# EAGLE design schematic_March8 (EAGLE 7.6.0)
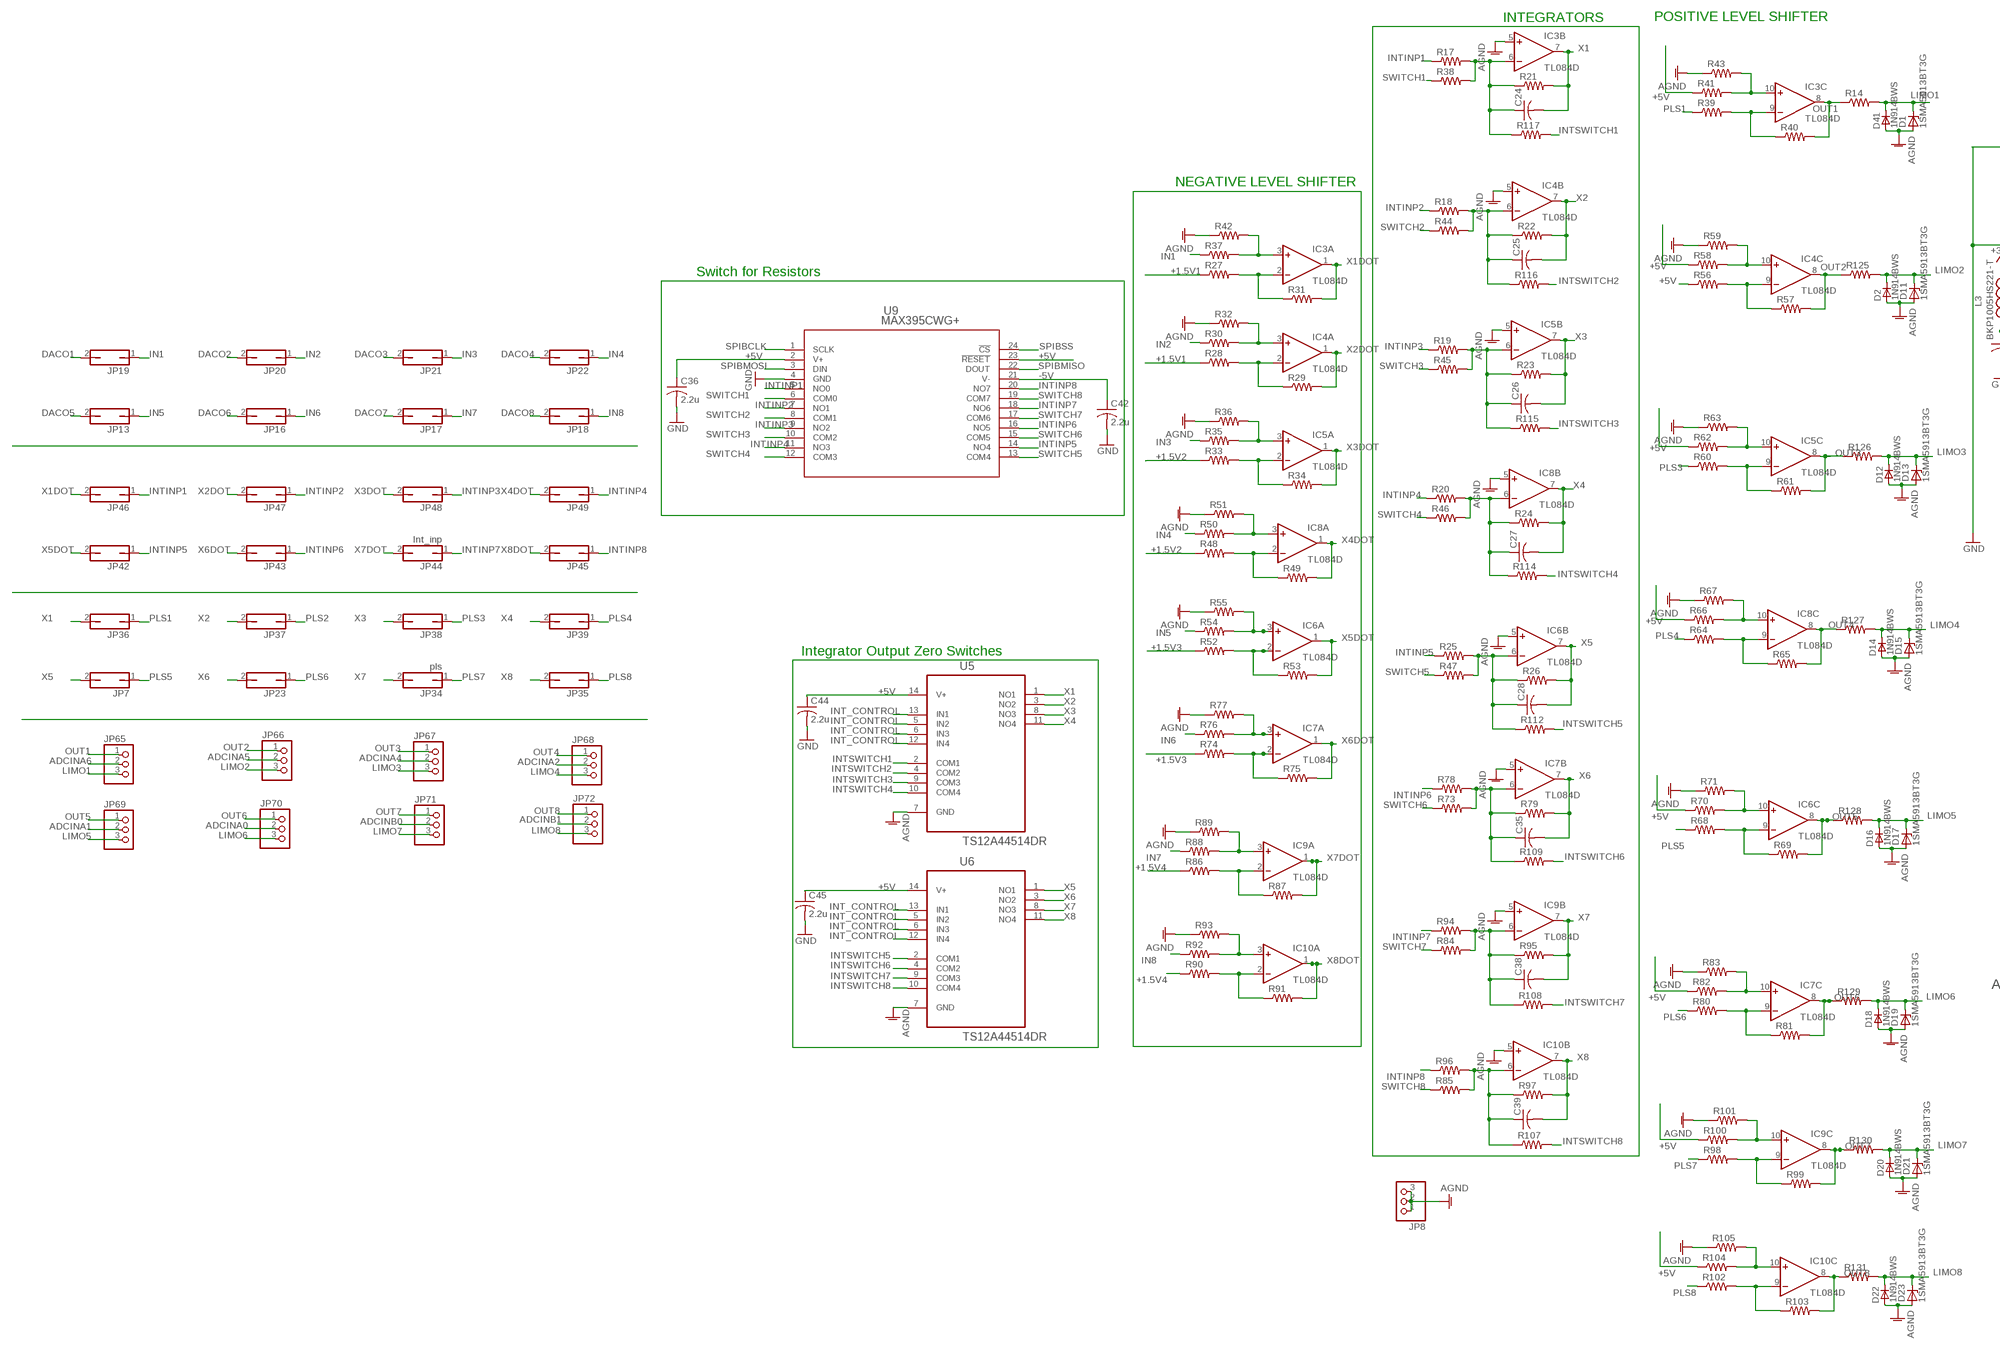
[diagram p0: schematic, sheet 1, part 1 of 2]
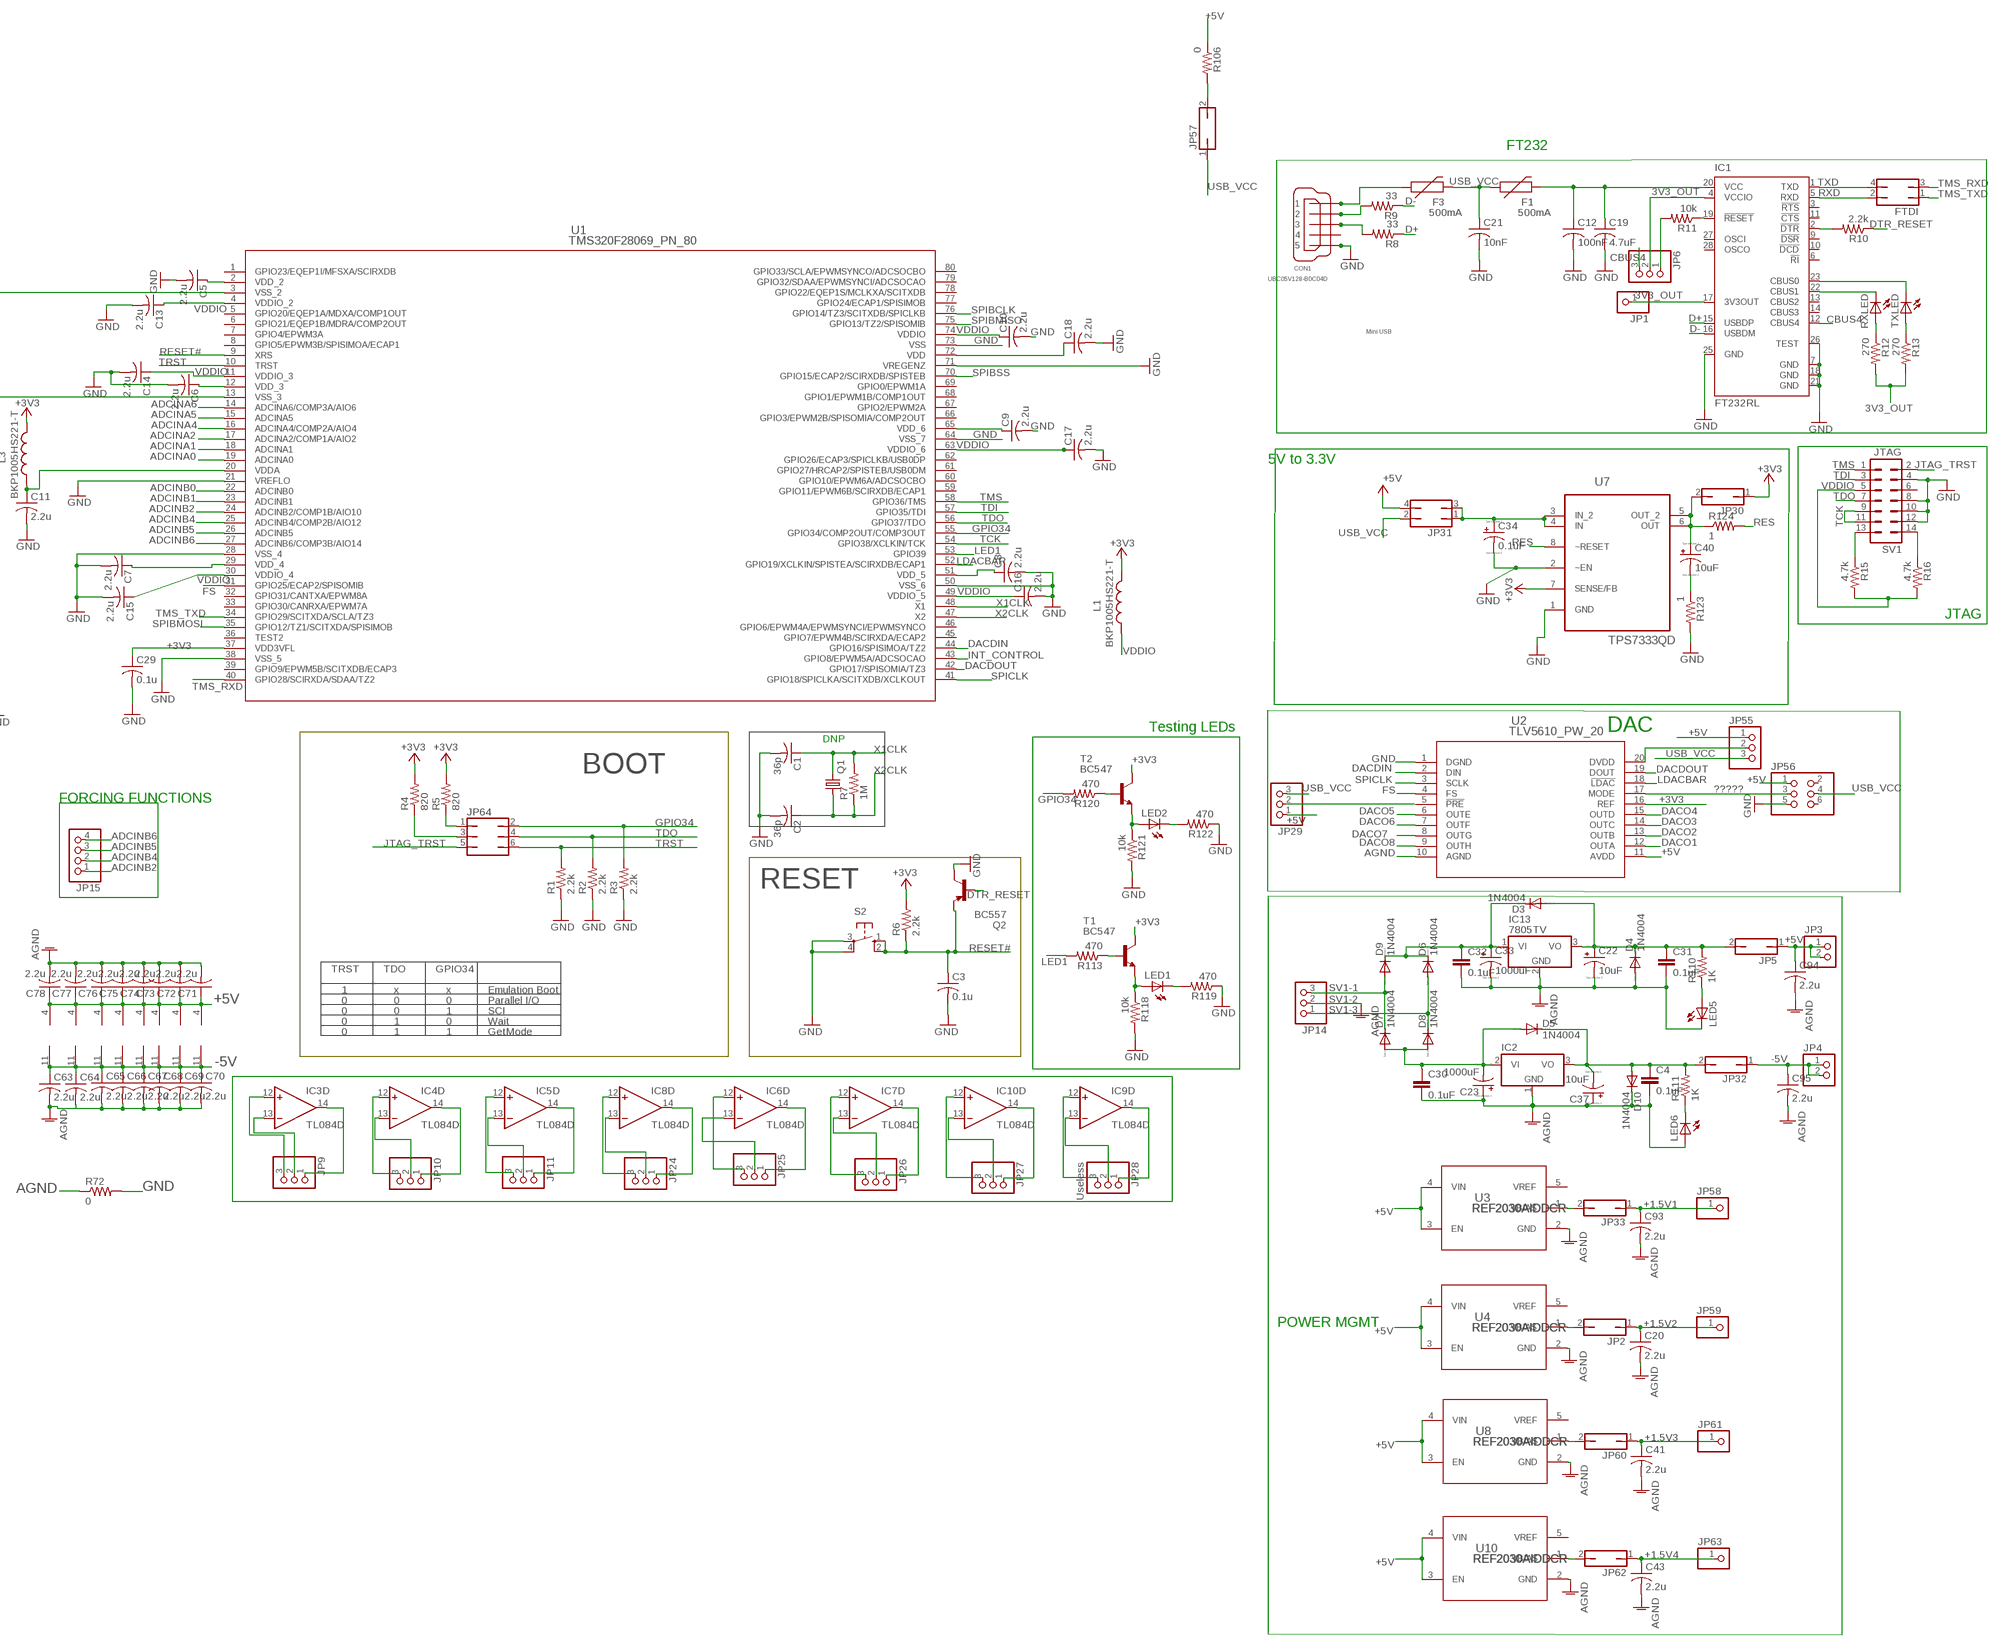
[diagram p1: schematic, sheet 1, part 2 of 2]

## Parts
C1  36p  C-USC1206  [C1206]
C2  36p  C-USC1206  [C1206]
C3  0.1u  C-USC1206  [C1206]
C4  0.1uF  C-EUC1206  [C1206]
C5  2.2u  C-USC1206  [C1206]
C6  2.2u  C-USC1206  [C1206]
C7  2.2u  C-USC1206  [C1206]
C8  2.2u  C-USC1206  [C1206]
C9  2.2u  C-USC1206  [C1206]
C10  2.2u  C-USC1206  [C1206]
C11  2.2u  C-USC1206  [C1206]
C12  100nF  C-USC1206  [C1206]
C13  2.2u  C-USC1206  [C1206]
C14  2.2u  C-USC1206  [C1206]
C15  2.2u  C-USC1206  [C1206]
C16  2.2u  C-USC1206  [C1206]
C17  2.2u  C-USC1206  [C1206]
C18  2.2u  C-USC1206  [C1206]
C19  4.7uF  C-USC1206  [C1206]
C20  2.2u  C-USC1206  [C1206]
C21  10nF  C-USC1206  [C1206]
C22  10uF  CPOL-USE2.5-7  [E2,5-7]
C23  1000uF  CPOL-USE2.5-7  [E2,5-7]
C24  C-USC1206  [C1206]
C25  C-USC1206  [C1206]
C26  C-USC1206  [C1206]
C27  C-USC1206  [C1206]
C28  C-USC1206  [C1206]
C29  0.1u  C-USC1206  [C1206]
C30  0.1uF  C-EUC1206  [C1206]
C31  0.1uF  C-EUC1206  [C1206]
C32  0.1uF  C-EUC1206  [C1206]
C33  1000uF  CPOL-USE2.5-7  [E2,5-7]
C34  0.1uF  CPOL-USE2.5-7  [E2,5-7]
C35  C-USC1206  [C1206]
C36  2.2u  C-USC1206  [C1206]
C37  10uF  CPOL-USE2.5-7  [E2,5-7]
C38  C-USC1206  [C1206]
C39  C-USC1206  [C1206]
C40  10uF  CPOL-USE2.5-7  [E2,5-7]
C41  2.2u  C-USC1206  [C1206]
C42  2.2u  C-USC1206  [C1206]
C43  2.2u  C-USC1206  [C1206]
C44  2.2u  C-USC1206  [C1206]
C45  2.2u  C-USC1206  [C1206]
C63  2.2u  C-USC1206  [C1206]
C64  2.2u  C-USC1206  [C1206]
C65  2.2u  C-USC1206  [C1206]
C66  2.2u  C-USC1206  [C1206]
C67  2.2u  C-USC1206  [C1206]
C68  2.2u  C-USC1206  [C1206]
C69  2.2u  C-USC1206  [C1206]
C70  2.2u  C-USC1206  [C1206]
C71  2.2u  C-USC1206  [C1206]
C72  2.2u  C-USC1206  [C1206]
C73  2.2u  C-USC1206  [C1206]
C74  2.2u  C-USC1206  [C1206]
C75  2.2u  C-USC1206  [C1206]
C76  2.2u  C-USC1206  [C1206]
C77  2.2u  C-USC1206  [C1206]
C78  2.2u  C-USC1206  [C1206]
C93  2.2u  C-USC1206  [C1206]
C94  2.2u  C-USC1206  [C1206]
C95  2.2u  C-USC1206  [C1206]
CON1  UBC05V128-B0C04D  MINI-USB-32005-201  [32005-201]
D1  1SMA5913BT3G  [DO214AC]
D2  1N914BWS  [SOD323F]
D3  1N4004  [DO41-10]
D4  1N4004  [DO41-10]
D5  1N4004  [DO41-10]
D6  1N4004  [DO41-10]
D7  1N4004  [DO41-10]
D8  1N4004  [DO41-10]
D9  1N4004  [DO41-10]
D10  1N4004  [DO41-10]
D11  1SMA5913BT3G  [DO214AC]
D12  1N914BWS  [SOD323F]
D13  1SMA5913BT3G  [DO214AC]
D14  1N914BWS  [SOD323F]
D15  1SMA5913BT3G  [DO214AC]
D16  1N914BWS  [SOD323F]
D17  1SMA5913BT3G  [DO214AC]
D18  1N914BWS  [SOD323F]
D19  1SMA5913BT3G  [DO214AC]
D20  1N914BWS  [SOD323F]
D21  1SMA5913BT3G  [DO214AC]
D22  1N914BWS  [SOD323F]
D23  1SMA5913BT3G  [DO214AC]
D41  1N914BWS  [SOD323F]
F1  500mA  PTC0603  [0603]
F3  500mA  PTC0603  [0603]
FTDI  JP2Q  [JP2Q]
IC1  FT232RL  [SSOP28]
IC2  7905T  [TO220H]
IC3  TL084D  [SO14]
IC4  TL084D  [SO14]
IC5  TL084D  [SO14]
IC6  TL084D  [SO14]
IC7  TL084D  [SO14]
IC8  TL084D  [SO14]
IC9  TL084D  [SO14]
IC10  TL084D  [SO14]
IC13  7805TV  [TO220V]
JP1  PINHD-1X1  [1X01]
JP2  JP1Q  [JP1]
JP3  PINHD-1X2  [1X02]
JP4  PINHD-1X2  [1X02]
JP5  JP1Q  [JP1]
JP6  PINHD-1X3  [1X03]
JP7  JP1Q  [JP1]
JP8  PINHD-1X3  [1X03]
JP9  PINHD-1X3  [1X03]
JP10  PINHD-1X3  [1X03]
JP11  PINHD-1X3  [1X03]
JP13  JP1Q  [JP1]
JP14  PINHD-1X3  [1X03]
JP15  PINHD-1X4  [1X04]
JP16  JP1Q  [JP1]
JP17  JP1Q  [JP1]
JP18  JP1Q  [JP1]
JP19  JP1Q  [JP1]
JP20  JP1Q  [JP1]
JP21  JP1Q  [JP1]
JP22  JP1Q  [JP1]
JP23  JP1Q  [JP1]
JP24  PINHD-1X3  [1X03]
JP25  PINHD-1X3  [1X03]
JP26  PINHD-1X3  [1X03]
JP27  PINHD-1X3  [1X03]
JP28  Useless  PINHD-1X3  [1X03]
JP29  PINHD-1X3  [1X03]
JP30  JP1Q  [JP1]
JP31  JP2Q  [JP2Q]
JP32  JP1Q  [JP1]
JP33  JP1Q  [JP1]
JP34  pls  JP1Q  [JP1]
JP35  JP1Q  [JP1]
JP36  JP1Q  [JP1]
JP37  JP1Q  [JP1]
JP38  JP1Q  [JP1]
JP39  JP1Q  [JP1]
JP42  JP1Q  [JP1]
JP43  JP1Q  [JP1]
JP44  Int_inp  JP1Q  [JP1]
JP45  JP1Q  [JP1]
JP46  JP1Q  [JP1]
JP47  JP1Q  [JP1]
JP48  JP1Q  [JP1]
JP49  JP1Q  [JP1]
JP55  PINHD-1X3  [1X03]
JP56  PINHD-2X3  [2X03]
JP57  JP1Q  [JP1]
JP58  PINHD-1X1  [1X01]
JP59  PINHD-1X1  [1X01]
JP60  JP1Q  [JP1]
JP61  PINHD-1X1  [1X01]
JP62  JP1Q  [JP1]
JP63  PINHD-1X1  [1X01]
JP64  JP3Q  [JP3Q]
JP65  PINHD-1X3  [1X03]
JP66  PINHD-1X3  [1X03]
JP67  PINHD-1X3  [1X03]
JP68  PINHD-1X3  [1X03]
JP69  PINHD-1X3  [1X03]
JP70  PINHD-1X3  [1X03]
JP71  PINHD-1X3  [1X03]
JP72  PINHD-1X3  [1X03]
L1  BKP1005HS221-T  L-US0204/5  [0204/5]
L3  BKP1005HS221-T  L-US0204/5  [0204/5]
LED1  LED3MM  [LED3MM]
LED2  LED3MM  [LED3MM]
LED5  LED3MM  [LED3MM]
LED6  LED3MM  [LED3MM]
Q1  CRYSTALHC49S  [HC49/S]
Q2  BC557  [TO92-EBC]
R1  2.2k  R-US_R1206  [R1206]
R2  2.2k  R-US_R1206  [R1206]
R3  2.2k  R-US_R1206  [R1206]
R4  820  R-US_R1206  [R1206]
R5  820  R-US_R1206  [R1206]
R6  2.2k  R-US_R1206  [R1206]
R7  1M  R-US_R1206  [R1206]
R8  33  R-US_R1206  [R1206]
R9  33  R-US_R1206  [R1206]
R10  2.2k  R-US_R1206  [R1206]
R11  10k  R-US_R1206  [R1206]
R12  270  R-US_R1206  [R1206]
R13  270  R-US_R1206  [R1206]
R14  R-US_R1206  [R1206]
R15  4.7k  R-US_M1206  [M1206]
R16  4.7k  R-US_M1206  [M1206]
R17  R-US_R1206  [R1206]
R18  R-US_R1206  [R1206]
R19  R-US_R1206  [R1206]
R20  R-US_R1206  [R1206]
R21  R-US_R1206  [R1206]
R22  R-US_R1206  [R1206]
R23  R-US_R1206  [R1206]
R24  R-US_R1206  [R1206]
R25  R-US_R1206  [R1206]
R26  R-US_R1206  [R1206]
R27  R-US_R1206  [R1206]
R28  R-US_R1206  [R1206]
R29  R-US_R1206  [R1206]
R30  R-US_R1206  [R1206]
R31  R-US_R1206  [R1206]
R32  R-US_R1206  [R1206]
R33  R-US_R1206  [R1206]
R34  R-US_R1206  [R1206]
R35  R-US_R1206  [R1206]
R36  R-US_R1206  [R1206]
R37  R-US_R1206  [R1206]
R38  R-US_R1206  [R1206]
R39  R-US_R1206  [R1206]
R40  R-US_R1206  [R1206]
R41  R-US_R1206  [R1206]
R42  R-US_R1206  [R1206]
R43  R-US_R1206  [R1206]
R44  R-US_R1206  [R1206]
R45  R-US_R1206  [R1206]
R46  R-US_R1206  [R1206]
R47  R-US_R1206  [R1206]
R48  R-US_R1206  [R1206]
R49  R-US_R1206  [R1206]
R50  R-US_R1206  [R1206]
R51  R-US_R1206  [R1206]
R52  R-US_R1206  [R1206]
R53  R-US_R1206  [R1206]
R54  R-US_R1206  [R1206]
R55  R-US_R1206  [R1206]
R56  R-US_R1206  [R1206]
R57  R-US_R1206  [R1206]
R58  R-US_R1206  [R1206]
R59  R-US_R1206  [R1206]
R60  R-US_R1206  [R1206]
R61  R-US_R1206  [R1206]
R62  R-US_R1206  [R1206]
R63  R-US_R1206  [R1206]
R64  R-US_R1206  [R1206]
R65  R-US_R1206  [R1206]
R66  R-US_R1206  [R1206]
R67  R-US_R1206  [R1206]
R68  R-US_R1206  [R1206]
R69  R-US_R1206  [R1206]
R70  R-US_R1206  [R1206]
R71  R-US_R1206  [R1206]
R72  0  R-US_R1206  [R1206]
R73  R-US_R1206  [R1206]
R74  R-US_R1206  [R1206]
R75  R-US_R1206  [R1206]
R76  R-US_R1206  [R1206]
R77  R-US_R1206  [R1206]
R78  R-US_R1206  [R1206]
R79  R-US_R1206  [R1206]
R80  R-US_R1206  [R1206]
R81  R-US_R1206  [R1206]
R82  R-US_R1206  [R1206]
R83  R-US_R1206  [R1206]
R84  R-US_R1206  [R1206]
R85  R-US_R1206  [R1206]
R86  R-US_R1206  [R1206]
R87  R-US_R1206  [R1206]
R88  R-US_R1206  [R1206]
R89  R-US_R1206  [R1206]
R90  R-US_R1206  [R1206]
R91  R-US_R1206  [R1206]
R92  R-US_R1206  [R1206]
R93  R-US_R1206  [R1206]
R94  R-US_R1206  [R1206]
R95  R-US_R1206  [R1206]
R96  R-US_R1206  [R1206]
R97  R-US_R1206  [R1206]
R98  R-US_R1206  [R1206]
R99  R-US_R1206  [R1206]
R100  R-US_R1206  [R1206]
R101  R-US_R1206  [R1206]
R102  R-US_R1206  [R1206]
R103  R-US_R1206  [R1206]
R104  R-US_R1206  [R1206]
R105  R-US_R1206  [R1206]
R106  0  R-US_R1206  [R1206]
R107  R-US_R1206  [R1206]
R108  R-US_R1206  [R1206]
R109  R-US_R1206  [R1206]
R110  1K  R-US_0207/10  [0207/10]
R111  1K  R-US_0207/10  [0207/10]
R112  R-US_R1206  [R1206]
R113  470  R-US_R1206  [R1206]
R114  R-US_R1206  [R1206]
R115  R-US_R1206  [R1206]
R116  R-US_R1206  [R1206]
R117  R-US_R1206  [R1206]
R118  10k  R-US_R1206  [R1206]
R119  470  R-US_R1206  [R1206]
R120  470  R-US_R1206  [R1206]
R121  10k  R-US_R1206  [R1206]
R122  470  R-US_R1206  [R1206]
R123  1  R-US_M1206  [M1206]
R124  1  R-US_M1206  [M1206]
R125  R-US_R1206  [R1206]
R126  R-US_R1206  [R1206]
R127  R-US_R1206  [R1206]
R128  R-US_R1206  [R1206]
R129  R-US_R1206  [R1206]
R130  R-US_R1206  [R1206]
R131  R-US_R1206  [R1206]
RXLED  LEDCHIPLED_1206  [CHIPLED_1206]
S2  10-XX  [B3F-10XX]
SV1  JTAG  MA07-2  [MA07-2]
T1  BC547  [TO92]
T2  BC547  [TO92]
TXLED  LEDCHIPLED_1206  [CHIPLED_1206]
U1  TMS320F28069_PN_80  [PN80]
U2  TLV5610_PW_20  [PW20]
U3  REF2030AIDDCR  [DDC0005A_N]
U4  REF2030AIDDCR  [DDC0005A_N]
U5  TS12A44514DR  [SOIC127P600X175-14N]
U6  TS12A44514DR  [SOIC127P600X175-14N]
U7  TPS7333QD  [SOIC127P600X175-8N]
U8  REF2030AIDDCR  [DDC0005A_N]
U9  MAX395CWG+  [21-0042B_24]
U10  REF2030AIDDCR  [DDC0005A_N]

## Nets
3V3_OUT: IC1.4(VCCIO) IC1.17(3V3OUT) JP1.1 JP6.2 R12.2 R13.2
+1.5V1: C93.1 JP33.1 JP58.1 R27.1 R28.1
+1.5V2: C20.1 JP2.1 JP59.1 R33.1 R48.1
+1.5V3: C41.1 JP60.1 JP61.1 R52.1 R74.1
+1.5V4: C43.1 JP62.1 JP63.1 R86.1 R90.1
+3V3: C29.1 JP30.1 L1.2 L3.2 R4.2 R5.2 R6.2 T1.3(C) T2.3(C) U1.37(VDD3VFL) U2.16(REF) U7.7(SENSE/FB)
+5V: C36.1 C44.1 C45.1 C71.1 C72.1 C73.1 C74.1 C75.1 C76.1 C77.1 C78.1 C94.1 IC3.4(P:V+) IC4.4(P:V+) IC5.4(P:V+) IC6.4(P:V+) IC7.4(P:V+) IC8.4(P:V+) IC9.4(P:V+) IC10.4(P:V+) JP3.1 JP3.2 JP5.1 JP29.1 JP31.4 JP55.1 JP56.1 R41.1 R56.1 R58.1 R62.1 R66.1 R70.1 R82.1 R100.1 R104.1 R106.1 U2.11(AVDD) U3.3(EN) U3.4(VIN) U4.3(EN) U4.4(VIN) U5.14(V+) U6.14(V+) U8.3(EN) U8.4(VIN) U9.2(V+) U9.23(!RESET) U10.3(EN) U10.4(VIN) ; supply symbol labelled +3V3
-5V: C42.1 C63.1 C64.1 C65.1 C66.1 C67.1 C68.1 C69.1 C70.1 C95.1 IC3.11(P:V-) IC4.11(P:V-) IC5.11(P:V-) IC6.11(P:V-) IC7.11(P:V-) IC8.11(P:V-) IC9.11(P:V-) IC10.11(P:V-) JP4.1 JP4.2 JP32.1 U9.21(V-)
?????: JP56.3 U2.17(MODE)
ADCINA0: JP70.2 U1.19(ADCINA0)
ADCINA1: JP69.2 U1.18(ADCINA1)
ADCINA2: JP68.2 U1.17(ADCINA2/COMP1A/AIO2)
ADCINA4: JP67.2 U1.16(ADCINA4/COMP2A/AIO4)
ADCINA5: JP66.2 U1.15(ADCINA5)
ADCINA6: JP65.2 U1.14(ADCINA6/COMP3A/AIO6)
ADCINB0: JP71.2 U1.22(ADCINB0)
ADCINB1: JP72.2 U1.23(ADCINB1)
ADCINB2: JP15.1 U1.24(ADCINB2/COMP1B/AIO10)
ADCINB4: JP15.2 U1.25(ADCINB4/COMP2B/AIO12)
ADCINB5: JP15.3 U1.26(ADCINB5)
ADCINB6: JP15.4 U1.27(ADCINB6/COMP3B/AIO14)
AGND: C4.2 C20.2 C22.- C23.+ C30.2 C31.2 C32.2 C33.- C37.+ C41.2 C43.2 C63.2 C64.2 C65.2 C66.2 C67.2 C68.2 C69.2 C70.2 C71.2 C72.2 C73.2 C74.2 C75.2 C76.2 C77.2 C78.2 C93.2 C94.2 C95.2 D1.A D2.A D4.A D10.C D11.A D12.A D13.A D14.A D15.A D16.A D17.A D18.A D19.A D20.A D21.A D22.A D23.A D41.A IC2.1(GND) IC3.5(B:+IN) IC4.5(B:+IN) IC5.5(B:+IN) IC6.5(B:+IN) IC7.5(B:+IN) IC8.5(B:+IN) IC9.5(B:+IN) IC10.5(B:+IN) IC13.2(GND) JP8.1 JP8.2 JP8.3 LED5.K(C) LED6.A R32.1 R36.1 R42.1 R43.1 R51.1 R55.1 R59.1 R63.1 R67.1 R71.1 R72.1 R77.1 R83.1 R89.1 R93.1 R101.1 R105.1 U2.10(AGND) U3.2(GND) U4.2(GND) U5.7(GND) U6.7(GND) U8.2(GND) U10.2(GND)
CBUS4: IC1.12(CBUS4) JP6.3
D+: IC1.15(USBDP) R8.1
D-: IC1.16(USBDM) R9.1
DACDIN: U1.44(GPIO16/SPISIMOA/TZ2) U2.2(DIN)
DACDOUT: U1.42(GPIO17/SPISOMIA/TZ3) U2.19(DOUT)
DACO1: JP19.2 U2.12(OUTA)
DACO2: JP20.2 U2.13(OUTB)
DACO3: JP21.2 U2.14(OUTC)
DACO4: JP22.2 U2.15(OUTD)
DACO5: JP13.2 U2.6(OUTE)
DACO6: JP16.2 U2.7(OUTF)
DACO7: JP17.2 U2.8(OUTG)
DACO8: JP18.2 U2.9(OUTH)
DTR_RESET: Q2.B R10.1
FS: U1.31(GPIO25/ECAP2/SPISOMIB) U2.4(FS)
GND: C1.2 C2.2 C3.2 C5.2 C6.2 C7.2 C8.2 C9.2 C10.2 C11.2 C12.2 C13.2 C14.2 C15.2 C16.2 C17.2 C18.2 C19.2 C21.2 C29.2 C34.- C36.2 C42.2 C44.2 C45.2 CON1.5 IC1.7(GND) IC1.18(GND) IC1.21(GND) IC1.25(GND) IC1.26(TEST) JP56.5 Q2.C R1.1 R2.1 R3.1 R72.2 R118.2 R119.1 R121.2 R122.1 R123.2 S2.3(P) S2.4(P1) SV1.4 SV1.8 SV1.10 SV1.12 U1.3(VSS_2) U1.13(VSS_3) U1.21(VREFLO) U1.28(VSS_4) U1.38(VSS_5) U1.50(VSS_6) U1.64(VSS_7) U1.71(VREGENZ) U1.73(VSS) U2.1(DGND) U7.1(GND) U7.2(~EN) U9.4(GND)
GPIO34: JP64.2 R3.2 R120.2 U1.55(GPIO34/COMP2OUT/COMP3OUT)
IDK: C22.+ C31.1 D3.A D4.C IC13.3(VO) JP5.2 R110.2
IDK2: C4.1 C37.- D5.C D10.A IC2.3(VO) JP32.2 R111.2
IN1: JP19.1 R37.1
IN2: JP20.1 R30.1
IN3: JP21.1 R35.1
IN4: JP22.1 R50.1
IN5: JP13.1 R54.1
IN6: JP16.1 R76.1
IN7: JP17.1 R88.1
IN8: JP18.1 R92.1
INT_CONTROL: U1.43(GPIO8/EPWM5A/ADCSOCAO) U5.5(IN2) U5.6(IN3) U5.12(IN4) U5.13(IN1) U6.5(IN2) U6.6(IN3) U6.12(IN4) U6.13(IN1)
INTINP1: JP46.1 R17.1 U9.5(NO0)
INTINP2: JP47.1 R18.1 U9.7(NO1)
INTINP3: JP48.1 R19.1 U9.9(NO2)
INTINP4: JP49.1 R20.1 U9.11(NO3)
INTINP5: JP42.1 R25.1 U9.14(NO4)
INTINP6: JP43.1 R78.1 U9.16(NO5)
INTINP7: JP44.1 R94.1 U9.18(NO6)
INTINP8: JP45.1 R96.1 U9.20(NO7)
INTSWITCH1: R117.2 U5.2(COM1)
INTSWITCH2: R116.2 U5.4(COM2)
INTSWITCH3: R115.2 U5.9(COM3)
INTSWITCH4: R114.2 U5.10(COM4)
INTSWITCH5: R112.2 U6.2(COM1)
INTSWITCH6: R109.2 U6.4(COM2)
INTSWITCH7: R108.2 U6.9(COM3)
INTSWITCH8: R107.2 U6.10(COM4)
JTAG_TRST: JP64.5 SV1.2
LDACBAR: U1.52(GPIO19/XCLKIN/SPISTEA/SCIRXDB/ECAP1) U2.18(!LDAC)
LED1: R113.2 U1.53(GPIO39)
LIMO1: D1.C D41.C JP65.3 R14.2
LIMO2: D2.C D11.C JP66.3 R125.2
LIMO3: D12.C D13.C JP67.3 R126.2
LIMO4: D14.C D15.C JP68.3 R127.2
LIMO5: D16.C D17.C JP69.3 R128.2
LIMO6: D18.C D19.C JP70.3 R129.2
LIMO7: D20.C D21.C JP71.3 R130.2
LIMO8: D22.C D23.C JP72.3 R131.2
N$1: C5.1 U1.2(VDD_2)
N$2: C6.1 U1.12(VDD_3)
N$3: C7.1 U1.29(VDD_4)
N$4: C8.1 U1.51(VDD_5)
N$5: C9.1 U1.65(VDD_6)
N$6: IC1.2(!DTR) R10.2
N$7: C11.1 L3.1 U1.20(VDDA)
N$8: C18.1 U1.72(VDD)
N$9: JP64.1 R5.1
N$10: JP64.3 R4.1
N$11: CON1.2 R9.2
N$12: CON1.3 R8.2
N$13: IC1.19(!RESET) R11.1
N$14: IC1.22(CBUS1) RXLED.C
N$15: IC1.23(CBUS0) TXLED.C
N$16: R12.1 RXLED.A
N$17: R13.1 TXLED.A
N$20: C25.1 IC4.6(B:-IN) R18.2 R22.1 R44.2 R116.1
N$21: C26.1 IC5.6(B:-IN) R19.2 R23.1 R45.2 R115.1
N$22: C27.1 IC8.6(B:-IN) R20.2 R24.1 R46.2 R114.1
N$23: IC4.2(A:-IN) R28.2 R29.1
N$24: R15.1 SV1.13
N$25: R16.1 SV1.14
N$26: IC4.3(A:+IN) R30.2 R32.2
N$28: C24.1 IC3.6(B:-IN) R17.2 R21.1 R38.2 R117.1
N$29: IC3.2(A:-IN) R27.2 R31.1
N$30: C28.1 IC6.6(B:-IN) R25.2 R26.1 R47.2 R112.1
N$31: IC5.2(A:-IN) R33.2 R34.1
N$33: IC3.3(A:+IN) R37.2 R42.2
N$35: IC5.3(A:+IN) R35.2 R36.2
N$36: IC3.9(C:-IN) R39.2 R40.1
N$38: IC3.10(C:+IN) R41.2 R43.2
N$39: IC8.2(A:-IN) R48.2 R49.1
N$40: IC8.3(A:+IN) R50.2 R51.2
N$41: IC7.2(A:-IN) R74.2 R75.1
N$42: IC6.2(A:-IN) R52.2 R53.1
N$44: IC6.3(A:+IN) R54.2 R55.2
N$45: IC7.3(A:+IN) R76.2 R77.2
N$46: IC8.12(D:+IN) JP24.3
N$47: IC4.9(C:-IN) R56.2 R57.1
N$48: IC4.10(C:+IN) R58.2 R59.2
N$49: IC5.9(C:-IN) R60.2 R61.1
N$50: IC5.10(C:+IN) R62.2 R63.2
N$51: IC8.9(C:-IN) R64.2 R65.1
N$52: IC8.10(C:+IN) R66.2 R67.2
N$53: IC6.9(C:-IN) R68.2 R69.1
N$54: IC6.10(C:+IN) R70.2 R71.2
N$55: C35.1 IC7.6(B:-IN) R73.2 R78.2 R79.1 R109.1
N$56: IC7.9(C:-IN) R80.2 R81.1
N$57: IC7.10(C:+IN) R82.2 R83.2
N$58: IC9.2(A:-IN) R86.2 R87.1
N$59: IC9.3(A:+IN) R88.2 R89.2
N$60: IC10.2(A:-IN) R90.2 R91.1
N$61: IC10.3(A:+IN) R92.2 R93.2
N$62: C38.1 IC9.6(B:-IN) R84.2 R94.2 R95.1 R108.1
N$63: C39.1 IC10.6(B:-IN) R85.2 R96.2 R97.1 R107.1
N$64: IC9.9(C:-IN) R98.2 R99.1
N$65: IC9.10(C:+IN) R100.2 R101.2
N$66: IC10.9(C:-IN) R102.2 R103.1
N$67: IC10.10(C:+IN) R104.2 R105.2
N$70: IC8.13(D:-IN) JP24.2
N$71: IC10.12(D:+IN) JP27.3
N$72: IC7.14(D:OUT) JP26.1
N$73: C32.1 C33.+ D3.C D6.C D9.C IC13.1(VI)
N$74: IC7.12(D:+IN) JP26.3
N$75: IC10.14(D:OUT) JP27.1
N$76: IC9.12(D:+IN) JP28.3
N$77: C40.+ JP30.2 R124.1 U7.5(OUT_2) U7.6(OUT)
N$78: C40.- R123.1
N$80: LED6.K(C) R111.1
N$81: C34.+ JP31.1 JP31.3 U7.3(IN_2) U7.4(IN)
N$82: LED5.A R110.1
N$83: CON1.1 F3.1
N$85: IC8.14(D:OUT) JP24.1
N$86: C23.- C30.1 D5.A D7.A D8.A IC2.2(VI)
N$87: IC6.13(D:-IN) JP25.2
N$88: IC6.12(D:+IN) JP25.3
N$89: IC6.14(D:OUT) JP25.1
N$90: IC7.13(D:-IN) JP26.2
N$91: JP33.2 U3.1(VBIAS)
N$93: IC10.13(D:-IN) JP27.2
N$95: JP6.1 R11.2
N$96: IC9.13(D:-IN) JP28.2
N$98: IC9.14(D:OUT) JP28.1
N$102: R113.1 T1.2(B)
N$104: LED1.A R118.1 T1.1(E)
N$105: LED1.K(C) R119.2
N$106: R120.1 T2.2(B)
N$107: LED2.A R121.1 T2.1(E)
N$108: LED2.K(C) R122.2
N$109: IC3.13(D:-IN) JP9.2
N$110: IC3.12(D:+IN) JP9.3
N$111: IC3.14(D:OUT) JP9.1
N$112: IC4.13(D:-IN) JP10.2
N$113: IC4.12(D:+IN) JP10.3
N$114: IC4.14(D:OUT) JP10.1
N$115: IC5.12(D:+IN) JP11.3
N$116: IC5.13(D:-IN) JP11.2
N$117: IC5.14(D:OUT) JP11.1
N$131: JP55.2 U2.20(DVDD)
N$132: JP2.2 U4.1(VBIAS)
N$133: JP29.2
N$134: JP57.2 R106.2
N$135: JP60.2 U8.1(VBIAS)
N$136: JP62.2 U10.1(VBIAS)
OUT1: IC3.8(C:OUT) JP65.1 R14.1 R40.2
OUT2: IC4.8(C:OUT) JP66.1 R57.2 R125.1
OUT3: IC5.8(C:OUT) JP67.1 R61.2 R126.1
OUT4: IC8.8(C:OUT) JP68.1 R65.2 R127.1
OUT5: IC6.8(C:OUT) JP69.1 R69.2 R128.1
OUT6: IC7.8(C:OUT) JP70.1 R81.2 R129.1
OUT7: IC9.8(C:OUT) JP71.1 R99.2 R130.1
OUT8: IC10.8(C:OUT) JP72.1 R103.2 R131.1
PLS1: JP36.1 R39.1
PLS2: JP37.1
PLS3: JP38.1 R60.1
PLS4: JP39.1 R64.1
PLS5: JP7.1 R68.1
PLS6: JP23.1 R80.1
PLS7: JP34.1 R98.1
PLS8: JP35.1 R102.1
RES: R124.2 U7.8(~RESET)
RESET#: C3.1 Q2.E R6.1 S2.1(S) S2.2(S1) U1.9(XRS)
RXD: FTDI.2 IC1.5(RXD)
SPIBCLK: U1.76(GPIO14/TZ3/SCITXDB/SPICLKB) U9.1(SCLK)
SPIBMISO: U1.75(GPIO13/TZ2/SPISOMIB) U9.22(DOUT)
SPIBMOSI: U1.35(GPIO12/TZ1/SCITXDA/SPISIMOB) U9.3(DIN)
SPIBSS: U1.70(GPIO15/ECAP2/SCIRXDB/SPISTEB) U9.24(!CS)
SPICLK: U1.41(GPIO18/SPICLKA/SCITXDB/XCLKOUT) U2.3(SCLK)
SV1-1: D7.C D9.A JP14.3
SV1-2: JP14.2 ; supply symbol labelled AGND
SV1-3: D6.A D8.C JP14.1
SWITCH1: R38.1 U9.6(COM0)
SWITCH2: R44.1 U9.8(COM1)
SWITCH3: R45.1 U9.10(COM2)
SWITCH4: R46.1 U9.12(COM3)
SWITCH5: R47.1 U9.13(COM4)
SWITCH6: R73.1 U9.15(COM5)
SWITCH7: R84.1 U9.17(COM6)
SWITCH8: R85.1 U9.19(COM7)
TCK: SV1.9 SV1.11 U1.54(GPIO38/XCLKIN/TCK)
TDI: SV1.3 U1.57(GPIO35/TDI)
TDO: JP64.4 R2.2 SV1.7 U1.56(GPIO37/TDO)
TMS: SV1.1 U1.58(GPIO36/TMS)
TMS_RXD: FTDI.3 U1.40(GPIO28/SCIRXDA/SDAA/TZ2)
TMS_TXD: FTDI.1 U1.34(GPIO29/SCITXDA/SCLA/TZ3)
TRST: JP64.6 R1.2 U1.10(TRST)
TXD: FTDI.4 IC1.1(TXD)
USB_VCC: C21.1 F1.1 F3.2 JP29.3 JP31.2 JP55.3 JP56.4 JP57.1
VCC [power]: C12.1 C19.1 F1.2 IC1.20(VCC)
VDDIO: C10.1 C13.1 C14.1 C15.1 C16.1 C17.1 L1.1 R15.2 R16.2 SV1.5 U1.4(VDDIO_2) U1.11(VDDIO_3) U1.30(VDDIO_4) U1.49(VDDIO_5) U1.63(VDDIO_6) U1.74(VDDIO)
X1: C24.2 IC3.7(B:OUT) JP36.2 R21.2 U5.1(NO1)
X1CLK: C1.1 Q1.2 R7.2 U1.48(X1)
X1DOT: IC3.1(A:OUT) JP46.2 R31.2
X2: C25.2 IC4.7(B:OUT) JP37.2 R22.2 U5.3(NO2)
X2CLK: C2.1 Q1.1 R7.1 U1.47(X2)
X2DOT: IC4.1(A:OUT) JP47.2 R29.2
X3: C26.2 IC5.7(B:OUT) JP38.2 R23.2 U5.8(NO3)
X3DOT: IC5.1(A:OUT) JP48.2 R34.2
X4: C27.2 IC8.7(B:OUT) JP39.2 R24.2 U5.11(NO4)
X4DOT: IC8.1(A:OUT) JP49.2 R49.2
X5: C28.2 IC6.7(B:OUT) JP7.2 R26.2 U6.1(NO1)
X5DOT: IC6.1(A:OUT) JP42.2 R53.2
X6: C35.2 IC7.7(B:OUT) JP23.2 R79.2 U6.3(NO2)
X6DOT: IC7.1(A:OUT) JP43.2 R75.2
X7: C38.2 IC9.7(B:OUT) JP34.2 R95.2 U6.8(NO3)
X7DOT: IC9.1(A:OUT) JP44.2 R87.2
X8: C39.2 IC10.7(B:OUT) JP35.2 R97.2 U6.11(NO4)
X8DOT: IC10.1(A:OUT) JP45.2 R91.2
Unconnected: CON1.4 IC1.3(!RTS) IC1.6(!RI) IC1.9(!DSR) IC1.10(!DCD) IC1.11(!CTS) IC1.13(CBUS2) IC1.14(CBUS3) IC1.27(OSCI) IC1.28(OSCO) JP56.2 JP56.6 SV1.6 U1.1(GPIO23/EQEP1I/MFSXA/SCIRXDB) U1.5(GPIO20/EQEP1A/MDXA/COMP1OUT) U1.6(GPIO21/EQEP1B/MDRA/COMP2OUT) U1.7(GPIO4/EPWM3A) U1.8(GPIO5/EPWM3B/SPISIMOA/ECAP1) U1.32(GPIO31/CANTXA/EPWM8A) U1.33(GPIO30/CANRXA/EPWM7A) U1.36(TEST2) U1.39(GPIO9/EPWM5B/SCITXDB/ECAP3) U1.45(GPIO7/EPWM4B/SCIRXDA/ECAP2) U1.46(GPIO6/EPWM4A/EPWMSYNCI/EPWMSYNCO) U1.59(GPIO11/EPWM6B/SCIRXDB/ECAP1) U1.60(GPIO10/EPWM6A/ADCSOCBO) U1.61(GPIO27/HRCAP2/SPISTEB/USB0DM) U1.62(GPIO26/ECAP3/SPICLKB/USB0DP) U1.66(GPIO3/EPWM2B/SPISOMIA/COMP2OUT) U1.67(GPIO2/EPWM2A) U1.68(GPIO1/EPWM1B/COMP1OUT) U1.69(GPIO0/EPWM1A) U1.77(GPIO24/ECAP1/SPISIMOB) U1.78(GPIO22/EQEP1S/MCLKXA/SCITXDB) U1.79(GPIO32/SDAA/EPWMSYNCI/ADCSOCAO) U1.80(GPIO33/SCLA/EPWMSYNCO/ADCSOCBO) U2.5(!PRE) U3.5(VREF) U4.5(VREF) U8.5(VREF) U10.5(VREF)

## Notes on the sheet
- FT232
- INTEGRATORS | POSITIVE LEVEL SHIFTER
- NEGATIVE LEVEL SHIFTER | Mini USB
- Switch for Resistors
- 5V to 3.3V
- JTAG
- Testing LEDs | DAC
- DNP
- BOOT
- FORCING FUNCTIONS
- Integrator Output Zero Switches
- RESET
- TRST | TDO | GPIO34
- 1 | x | x | Emulation Boot
- 0 | 0 | 0 | Parallel I/O
- 0 | 0 | 1 | SCI
- 0 | 1 | 0 | Wait
- 0 | 1 | 1 | GetMode
- POWER MGMT

## Library data of the parts
C1-C3 C5-C21 C29 C36 C41-C45 C63-C78 C93-C95 = resistor:C-US: CAPACITOR, American symbol
C4 C30-C32 = rcl:C-EU: CAPACITOR, European symbol
C22 C23 C33 C34 C37 C40 = resistor:CPOL-US: POLARIZED CAPACITOR, American symbol
C24-C28 C35 C38 C39 = rcl:C-US: CAPACITOR, American symbol
CON1 = con-cypressindustries:MINI-USB-: MINI USB-B Conector Source: www.cypressindustries.com; OC_FARNELL: unknown; OC_NEWARK: unknown
D1 D11 D13 D15 D17 D19 D21 D23 = zener:1SMA59*BT3G: 1SMA59xxBT3G Series 1.5 Watt Plastic Surface Mount Zener Voltage Regulators Source: http://www.onsemi.com/pub_link/Collateral/1SMA5913BT3-D.PDF; MF: ON Semiconductor; MPN: 1SMA5913BT3G; OC_FARNELL: 1431138; OC_NEWARK: 26K5252
D2 D12 D14 D16 D18 D20 D22 D41 = many_diodes:1N914BWS: 1N914BWS General Purpose Rectifier SMD-Version of 1N914 Case: MELF-MLL41 = DO 213 AB Author: Dipl.-Ing. FH Rainer Bayer HHN Hochschule Heilbronn, rainer.bayer@hs-heilbronn.de Ingenieurbüro ing-rb, mail@ing-rb.de
D3-D10 = diode:1N4004: DIODE general purpose rectifier, 1 A
F1 F3 = SparkFun:PTC: Resettable Fuse PTC Resettable Fuse. Spark Fun Electronics SKU : COM-08357
FTDI JP31 = jumper:JP2Q: JUMPER
IC1 = ftdichip:FT232R: Source: http://www.ftdichip.com/Documents/DataSheets/DS_FT232R_v104.pdf; MPN: FT232RL; OC_FARNELL: 1146032; OC_NEWARK: 91K9918
IC2 = linear:79*: Negative VOLTAGE REGULATOR
IC3-IC10 = linear:TL084: OP AMP
IC13 = linear:78*: Positive VOLTAGE REGULATOR Source: http://cache.national.com/ds/LM/LM78L05.pdf http://www.fairchildsemi.com/ds/LM/LM7805.pdf
JP1 JP58 JP59 JP61 JP63 = pinhead:PINHD-1X1: PIN HEADER
JP2 JP5 JP7 JP13 JP16-JP23 JP30 JP32-JP39 JP42-JP49 JP57 JP60 JP62 = jumper:JP1Q: JUMPER
JP3 JP4 = pinhead:PINHD-1X2: PIN HEADER
JP6 JP8-JP11 JP14 JP24-JP29 JP55 JP65-JP72 = pinhead:PINHD-1X3: PIN HEADER
JP15 = pinhead:PINHD-1X4: PIN HEADER
JP56 = pinhead:PINHD-2X3: PIN HEADER
JP64 = jumper:JP3Q: JUMPER
L1 L3 = rcl:L-US: INDUCTOR, American symbol
LED1 LED2 LED5 LED6 RXLED TXLED = led:LED: LED OSRAM: - CHIPLED LG R971, LG N971, LY N971, LG Q971, LY Q971, LO R971, LY R971 LH N974, LH R974 LS Q976, LO Q976, LY Q976 LO Q996 - Hyper CHIPLED LW Q18S LB Q993, LB Q99A, LB R99A - SideLED LS A670, LO A670, LY A670, LG A670, LP A670 LB A673, LV A673, LT A673, LW A673 LH A674 LY A675 LS A676, LA A676, LO A676, LY A676, LW A676 LS A679, LY A679, LG A679 - Hyper Micro SIDELED® LS Y876, LA Y876, LO Y876, LY Y876 LT Y87S - SmartLED LW L88C, LW L88S LB L89C, LB L89S, LG L890 LS L89K, LO L89K, LY L89K LS L896, LA L896, LO L896, LY L896 - TOPLED LS T670, LO T670, LY T670, LG T670, LP T670 LSG T670, LSP T670, LSY T670, LOP T670, LYG T670 LG T671, LOG T671, LSG T671 LB T673, LV T673, LT T673, LW T673 LH T674 LS T676, LA T676, LO T676, LY T676, LB T676, LH T676, LSB T676, LW T676 LB T67C, LV T67C, LT T67C, LS T67K, LO T67K, LY T67K, LW E67C LS E67B, LA E67B, LO E67B, LY E67B, LB E67C, LV E67C, LT E67C LW T67C LS T679, LY T679, LG T679 LS T770, LO T770, LY T770, LG T770, LP T770 LB T773, LV T773, LT T773, LW T773 LH T774 LS E675, LA E675, LY E675, LS T675 LS T776, LA T776, LO T776, LY T776, LB T776 LHGB T686 LT T68C, LB T68C - Hyper Mini TOPLED® LB M676 - Mini TOPLED Santana® LG M470 LS M47K, LO M47K, LY M47K Source: http://www.osram.convergy.de LUXEON: - LUMILED® LXK2-PW12-R00, LXK2-PW12-S00, LXK2-PW14-U00, LXK2-PW14-V00 LXK2-PM12-R00, LXK2-PM12-S00, LXK2-PM14-U00 LXK2-PE12-Q00, LXK2-PE12-R00, LXK2-PE12-S00, LXK2-PE14-T00, LXK2-PE14-U00 LXK2-PB12-K00, LXK2-PB12-L00, LXK2-PB12-M00, LXK2-PB14-N00, LXK2-PB14-P00, LXK2-PB14-Q00 LXK2-PR12-L00, LXK2-PR12-M00, LXK2-PR14-Q00, LXK2-PR14-R00 LXK2-PD12-Q00, LXK2-PD12-R00, LXK2-PD12-S00 LXK2-PH12-R00, LXK2-PH12-S00 LXK2-PL12-P00, LXK2-PL12-Q00, LXK2-PL12-R00 Source: www.luxeon.com KINGBRIGHT: KA-3528ASYC Source: www.kingbright.com
Q1 = crystal:CRYSTAL: CRYSTAL; OC_FARNELL: 1667008; OC_NEWARK: unknown
Q2 = transistor-pnp:BC557*: PNP Transistror
R1-R13 R106 R110 R111 R113 R118-R122 = resistor:R-US_: RESISTOR, American symbol
R14-R105 R107-R109 R112 R114-R117 R123-R131 = rcl:R-US_: RESISTOR, American symbol
S2 = switch-omron:10-XX: OMRON SWITCH; MPN: B3F-1000; OC_FARNELL: 176432; OC_NEWARK: 36M3542
SV1 = con-lstb:MA07-2: PIN HEADER; OC_FARNELL: unknown; OC_NEWARK: unknown
T1 T2 = transistor-neu-to92:BC547: NPN TRANSISTOR
U1 = uP:TMS320F28069_PN_80; MANUFACTURER_PART_NUMBER: tms320f28069_pn_80; VENDOR: Texas Instruments
U2 = TLV5610:TLV5610_PW_20; MANUFACTURER_PART_NUMBER: tlv5610_pw_20; VENDOR: Texas Instruments
U3 U4 U8 U10 = ref2030:REF2030AIDDCR
U5 U6 = Texas Instruments_By_element14_Batch_1:TS12A44514DR: QUAD SPST CMOS ANALOG SWITCHES; MPN: TS12A44514DR; OC_FARNELL: 1755398; OC_NEWARK: 95M0176; PACKAGE: SOIC-14; SUPPLIER: Texas Instruments
U7 = Texas Instruments_By_element14_Batch_1:TPS7333QD: LOW-DROPOUT VOLTAGE REGULATORS; MPN: TPS7333QD; OC_FARNELL: -; OC_NEWARK: 52F2803; PACKAGE: SOIC-8; SUPPLIER: Texas Instruments
U9 = MAX395:MAX395CWG+; MANUFACTURER_PART_NUMBER: MAX395CWG+; VENDOR: Maxim Integrated Products

## Net classes
1 power: width 0.254 mm

## Board
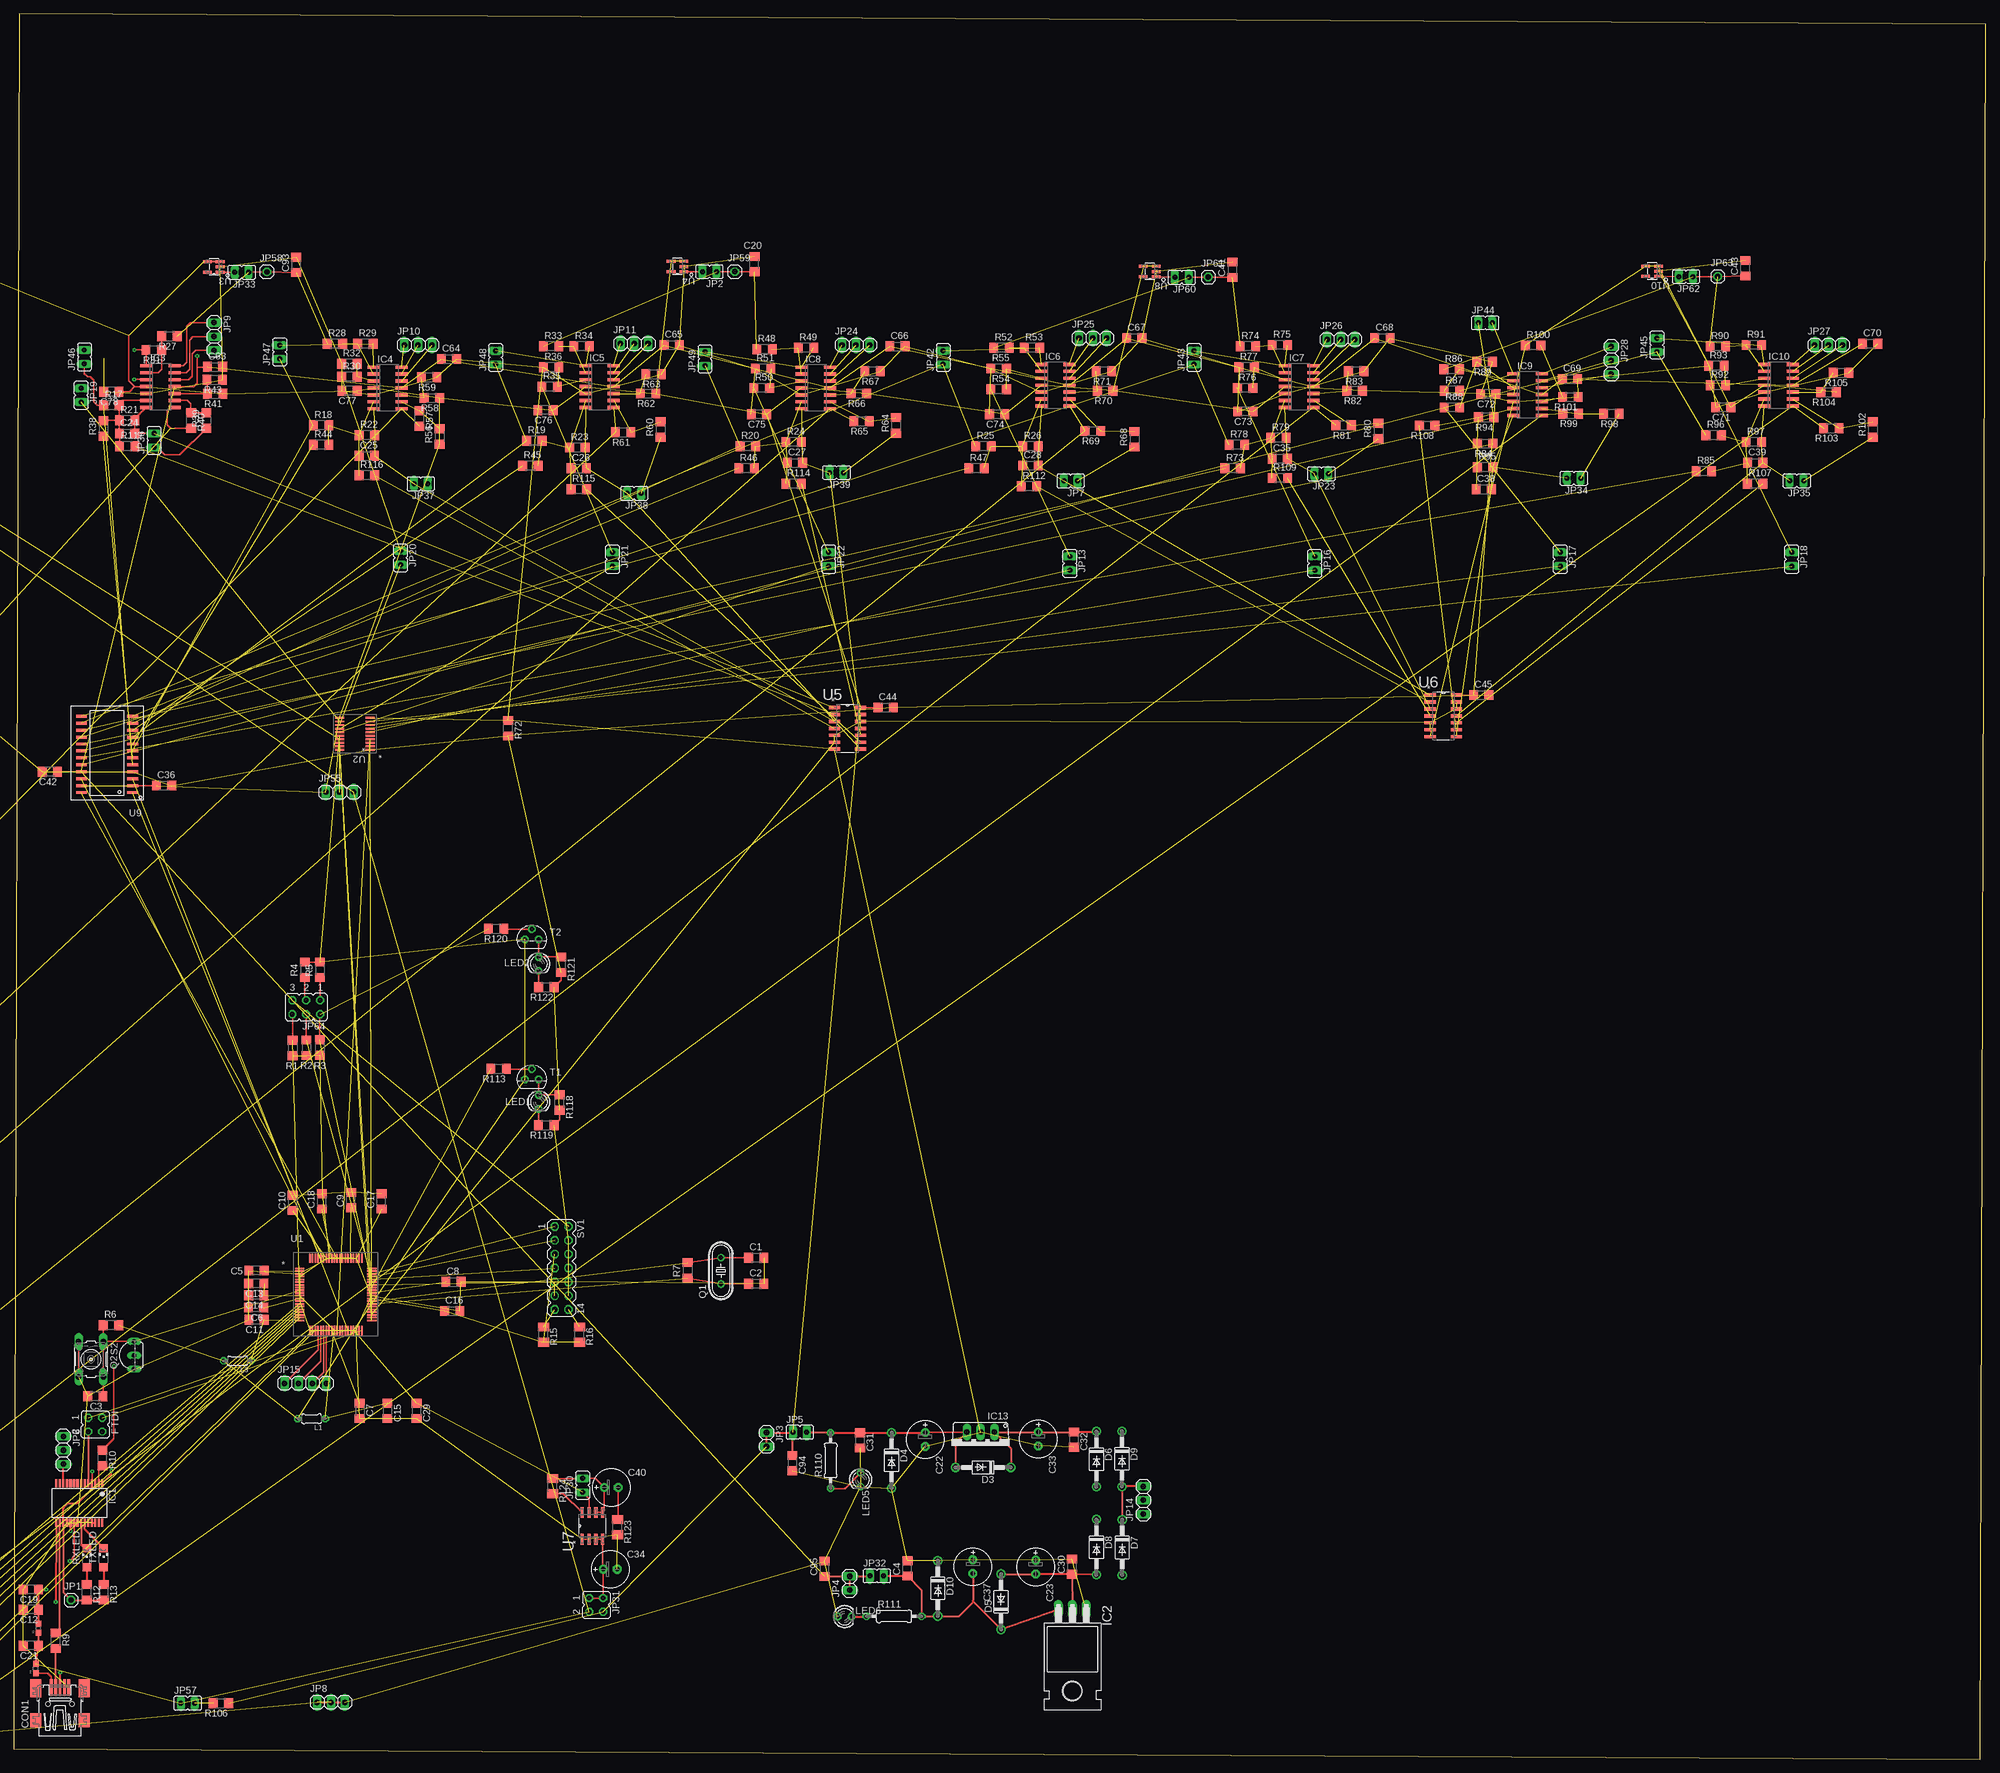
[diagram p2: board, top side]
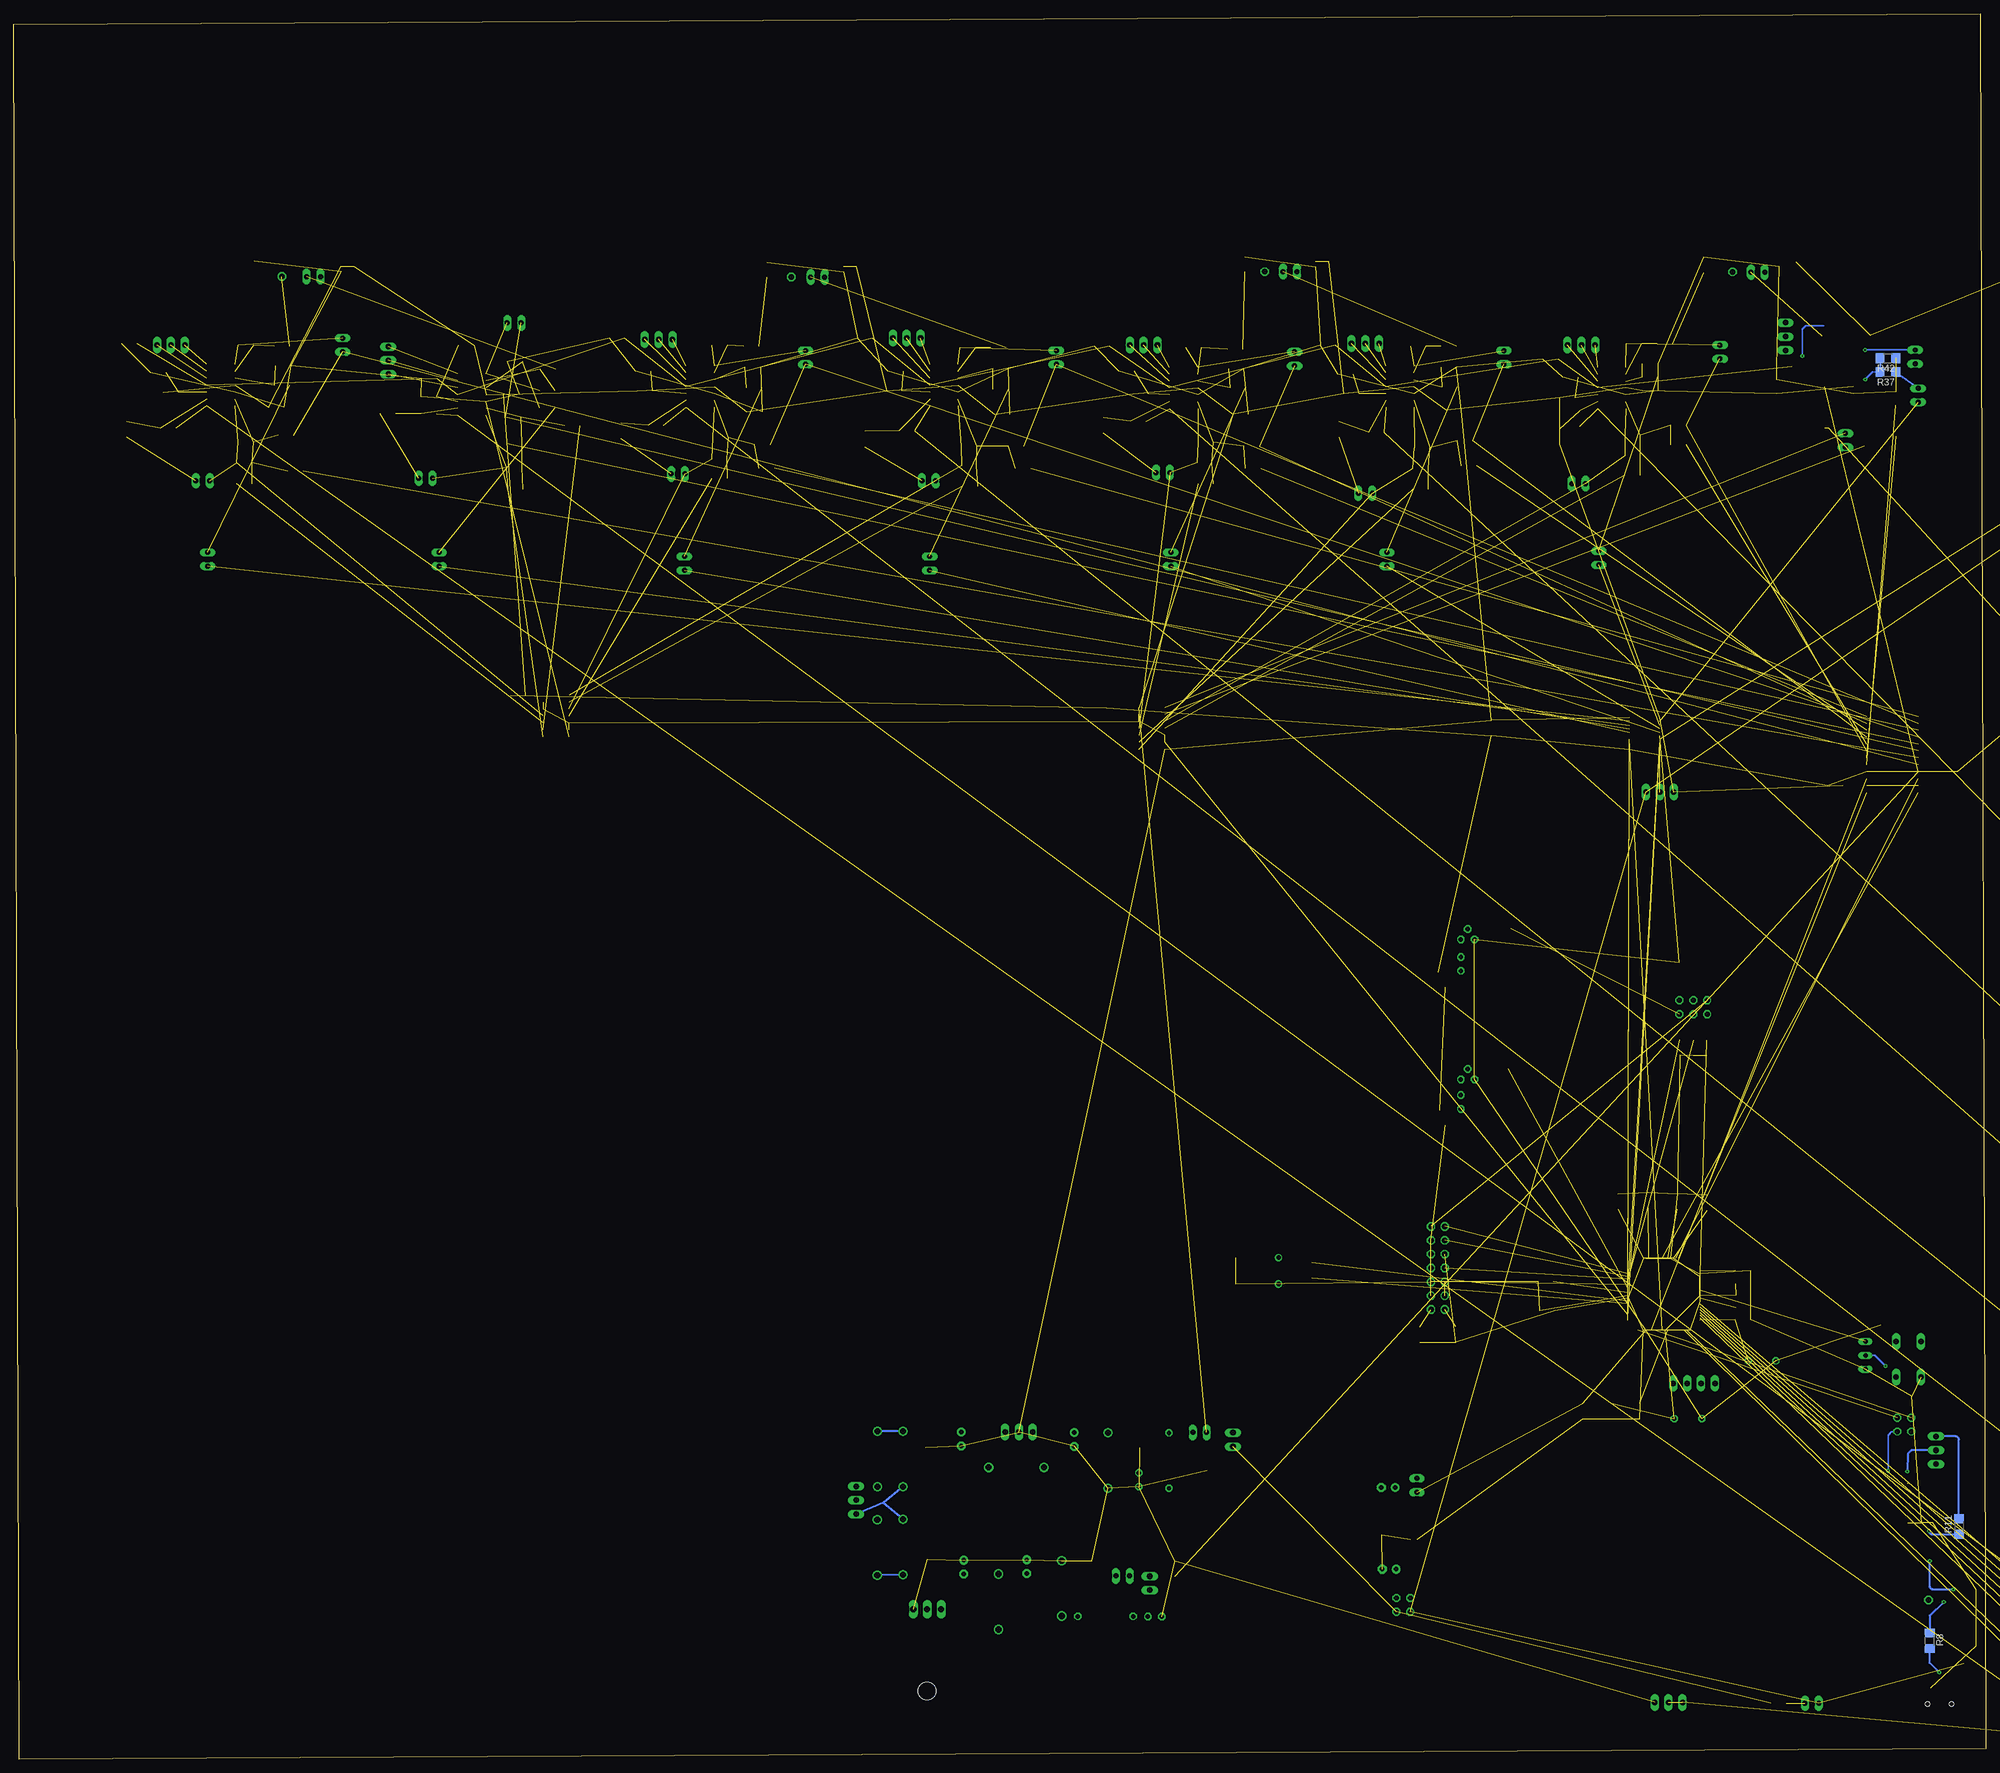
[diagram p3: board, bottom side, seen from below]

Size 361.55 x 319.94 mm. Coordinates in mm from the lower left corner, seen from the top.
Outline: 0,1.91 360.56,0 361.55,318.03 0.99,319.94 0,1.91
Copper layers (1*16): Top 0.035mm / dielectric 1.5mm / Bottom 0.035mm
Design rules "default *": minimum track width 8mil, minimum drill 10mil, track to track 7mil, track to pad 7mil, pad to pad 7mil, via to via 7mil, smd to smd 7mil, copper to edge 10mil, drill to drill 7mil, minimum pad ring 10mil, minimum via ring 8mil, stop-mask expansion 4mil, vias tented up to drill 0mil, thermal gap 10mil

### Footprints (pad centres in the part's own frame; a part is rotated, then mirrored left to right if it is on the bottom)
C1206 = smd 1.6 x 1.8: 1 -1.4,0; 2 1.4,0
E2,5-7 = drill 0.813 pad 1.6: + -1.27,0 | drill 0.813 pad 1.6 octagon: - 1.27,0
32005-201 = smd 3.1 x 0.5: 1 3,1.6; 2 3,0.8; 3 3,0; 4 3,-0.8; 5 3,-1.6 | smd 2.5 x 2: M1 -3,-4.45; M2 -3,4.45 | smd 3.3 x 2: M3 2.9,4.45; M4 2.9,-4.45 | hole 0.9: 0,2.2; 0,-2.2
DO214AC = smd 2.5 x 1.7: A 2,0; C -2,0
SOD323F = smd 1 x 0.6: A 1.1,0; C -1.1,0
DO41-10 = drill 1.118: A 5.08,0; C -5.08,0
0603 = smd 1.1 x 1: 1 -0.85,0; 2 0.85,0
JP2Q = drill 0.914 octagon: 1 -1.27,-1.27; 2 1.27,-1.27; 3 -1.27,1.27; 4 1.27,1.27
SSOP28 = smd 0.4 x 1.5: 1 -4.225,-3.625; 2 -3.575,-3.625; 3 -2.925,-3.625; 4 -2.275,-3.625; 5 -1.625,-3.625; 6 -0.975,-3.625; 7 -0.325,-3.625; 8 0.325,-3.625; 9 0.975,-3.625; 10 1.625,-3.625; 11 2.275,-3.625; 12 2.925,-3.625; 13 3.575,-3.625; 14 4.225,-3.625; 15 4.225,3.625; 16 3.575,3.625; 17 2.925,3.625; 18 2.275,3.625; 19 1.625,3.625; 20 0.975,3.625; 21 0.325,3.625; 22 -0.325,3.625; 23 -0.975,3.625; 24 -1.625,3.625; 25 -2.275,3.625; 26 -2.925,3.625; 27 -3.575,3.625; 28 -4.225,3.625
TO220H = drill 1.118 long: 1 -2.54,-10.16; 2 0,-10.16; 3 2.54,-10.16 | hole 3.302: 0,4.826
SO14 = smd 0.6 x 2.2: 1 -3.81,-2.6; 2 -2.54,-2.6; 3 -1.27,-2.6; 4 0,-2.6; 5 1.27,-2.6; 6 2.54,-2.6; 7 3.81,-2.6; 8 3.81,2.6; 9 2.54,2.6; 10 1.27,2.6; 11 0,2.6; 12 -1.27,2.6; 13 -2.54,2.6; 14 -3.81,2.6
TO220V = drill 1.016 long: 1 -2.54,-2.54; 2 0,-2.54; 3 2.54,-2.54
1X01 = drill 1.016 octagon: 1 0,0
JP1 = drill 0.914 long: 1 0,-1.27; 2 0,1.27
1X02 = drill 1.016 long: 1 -1.27,0; 2 1.27,0
1X03 = drill 1.016 long: 1 -2.54,0; 2 0,0; 3 2.54,0
1X04 = drill 1.016 long: 1 -3.81,0; 2 -1.27,0; 3 1.27,0; 4 3.81,0
2X03 = drill 1.016 octagon: 1 -2.54,-1.27; 2 -2.54,1.27; 3 0,-1.27; 4 0,1.27; 5 2.54,-1.27; 6 2.54,1.27
JP3Q = drill 0.914 octagon: 1 -2.54,-1.27; 2 -2.54,1.27; 3 0,-1.27; 4 0,1.27; 5 2.54,-1.27; 6 2.54,1.27
0204/5 = drill 0.813 octagon: 1 -2.54,0; 2 2.54,0
LED3MM = drill 0.813 octagon: A -1.27,0; K 1.27,0
HC49/S = drill 0.813: 1 -2.413,0; 2 2.413,0
TO92-EBC = drill 0.813 long: B 0,-1.27; C -2.54,-1.27; E 2.54,-1.27
R1206 = smd 1.6 x 1.803: 1 -1.422,0; 2 1.422,0
M1206 = smd 1.6 x 2: 1 -1.4,0; 2 1.4,0
0207/10 = drill 0.813 octagon: 1 -5.08,0; 2 5.08,0
CHIPLED_1206 = smd 1.5 x 1.5: A 0,-1.75; C 0,1.75
B3F-10XX = drill 1.016 long: 1 -3.251,2.261; 2 3.251,2.261; 3 -3.251,-2.261; 4 3.251,-2.261
MA07-2 = drill 1.016 octagon: 1 -7.62,-1.27; 2 -7.62,1.27; 3 -5.08,-1.27; 4 -5.08,1.27; 5 -2.54,-1.27; 6 -2.54,1.27; 7 0,-1.27; 8 0,1.27; 9 2.54,-1.27; 10 2.54,1.27; 11 5.08,-1.27; 12 5.08,1.27; 13 7.62,-1.27; 14 7.62,1.27
TO92 = drill 0.813 octagon: 1 1.27,0; 2 0,1.905; 3 -1.27,0
PN80 = smd 1.676 x 0.279: 1 -6.617,4.75; 2 -6.617,4.25; 3 -6.617,3.75; 4 -6.617,3.25; 5 -6.617,2.75; 6 -6.617,2.25; 7 -6.617,1.75; 8 -6.617,1.25; 9 -6.617,0.75; 10 -6.617,0.25; 11 -6.617,-0.25; 12 -6.617,-0.75; 13 -6.617,-1.25; 14 -6.617,-1.75; 15 -6.617,-2.25; 16 -6.617,-2.75; 17 -6.617,-3.25; 18 -6.617,-3.75; 19 -6.617,-4.25; 20 -6.617,-4.75; 41 6.617,-4.75; 42 6.617,-4.25; 43 6.617,-3.75; 44 6.617,-3.25; 45 6.617,-2.75; 46 6.617,-2.25; 47 6.617,-1.75; 48 6.617,-1.25; 49 6.617,-0.75; 50 6.617,-0.25; 51 6.617,0.25; 52 6.617,0.75; 53 6.617,1.25; 54 6.617,1.75; 55 6.617,2.25; 56 6.617,2.75; 57 6.617,3.25; 58 6.617,3.75; 59 6.617,4.25; 60 6.617,4.75 | smd 0.279 x 1.676: 21 -4.75,-6.617; 22 -4.25,-6.617; 23 -3.75,-6.617; 24 -3.25,-6.617; 25 -2.75,-6.617; 26 -2.25,-6.617; 27 -1.75,-6.617; 28 -1.25,-6.617; 29 -0.75,-6.617; 30 -0.25,-6.617; 31 0.25,-6.617; 32 0.75,-6.617; 33 1.25,-6.617; 34 1.75,-6.617; 35 2.25,-6.617; 36 2.75,-6.617; 37 3.25,-6.617; 38 3.75,-6.617; 39 4.25,-6.617; 40 4.75,-6.617; 61 4.75,6.617; 62 4.25,6.617; 63 3.75,6.617; 64 3.25,6.617; 65 2.75,6.617; 66 2.25,6.617; 67 1.75,6.617; 68 1.25,6.617; 69 0.75,6.617; 70 0.25,6.617; 71 -0.25,6.617; 72 -0.75,6.617; 73 -1.25,6.617; 74 -1.75,6.617; 75 -2.25,6.617; 76 -2.75,6.617; 77 -3.25,6.617; 78 -3.75,6.617; 79 -4.25,6.617; 80 -4.75,6.617
PW20 = smd 1.676 x 0.356: 1 -2.819,2.925; 2 -2.819,2.275; 3 -2.819,1.625; 4 -2.819,0.975; 5 -2.819,0.325; 6 -2.819,-0.325; 7 -2.819,-0.975; 8 -2.819,-1.625; 9 -2.819,-2.275; 10 -2.819,-2.925; 11 2.819,-2.925; 12 2.819,-2.275; 13 2.819,-1.625; 14 2.819,-0.975; 15 2.819,-0.325; 16 2.819,0.325; 17 2.819,0.975; 18 2.819,1.625; 19 2.819,2.275; 20 2.819,2.925
DDC0005A_N = smd 1.575 x 0.559: 1 -1.168,0.95; 2 -1.168,0; 3 -1.168,-0.95; 4 1.168,-0.95; 5 1.168,0.95
SOIC127P600X175-14N = smd 2.057 x 0.61: 1 -4.801,7.62; 2 -4.801,6.35; 3 -4.801,5.08; 4 -4.801,3.81; 5 -4.801,2.54; 6 -4.801,1.27; 7 -4.801,0; 8 0,0; 9 0,1.27; 10 0,2.54; 11 0,3.81; 12 0,5.08; 13 0,6.35; 14 0,7.62
SOIC127P600X175-8N = smd 1.981 x 0.559: 1 -2.464,1.905; 2 -2.464,0.635; 3 -2.464,-0.635; 4 -2.464,-1.905; 5 2.464,-1.905; 6 2.464,-0.635; 7 2.464,0.635; 8 2.464,1.905
21-0042B_24 = smd 1.981 x 0.533: 1 -4.686,6.985; 2 -4.686,5.715; 3 -4.686,4.445; 4 -4.686,3.175; 5 -4.686,1.905; 6 -4.686,0.635; 7 -4.686,-0.635; 8 -4.686,-1.905; 9 -4.686,-3.175; 10 -4.686,-4.445; 11 -4.686,-5.715; 12 -4.686,-6.985; 13 4.686,-6.985; 14 4.686,-5.715; 15 4.686,-4.445; 16 4.686,-3.175; 17 4.686,-1.905; 18 4.686,-0.635; 19 4.686,0.635; 20 4.686,1.905; 21 4.686,3.175; 22 4.686,4.445; 23 4.686,5.715; 24 4.686,6.985

### Placement (x,y rotation side)
C1  136.14,91.95 0 top
C2  136.14,87.17 0 top
C3  14.99,66.52 180 top
C4  163.86,35 90 top
C5  44.53,89.59 180 top
C6  44.45,82.8 180 top
C7  63.45,63.86 270 top
C8  80.64,87.5 0 top
C9  61.85,102.49 90 top
C10  51.18,101.98 90 top
C11  44.53,80.57 180 top
C12  3.17,27.43 180 top
C13  44.5,87.2 180 top
C14  44.48,85.06 180 top
C15  68.53,63.86 270 top
C16  80.39,82.17 0 top
C17  67.44,102.23 90 top
C18  56.52,102.23 90 top
C19  3.17,31.11 180 top
C20  135.81,274.02 90 top
C21  3.17,20.83 180 top
C22  167.11,58.62 270 top
C23  187.35,35.23 270 top
C24  20.8,243 0 top
C25  64.74,238.89 0 top
C26  103.61,236.6 0 top
C27  143.23,237.62 0 top
C28  186.41,237.11 0 top
C29  73.86,63.86 270 top
C30  194.03,35.31 90 top
C31  155.14,58.47 270 top
C32  194.36,58.6 270 top
C33  187.83,58.7 270 top
C34  109.37,34.85 0 top
C35  232.13,238.38 0 top
C36  27.58,178.46 0 top
C37  175.84,35.31 270 top
C38  269.52,232.77 0 top
C39  319.25,237.62 0 top
C40  109.55,49.83 0 top
C41  223.44,273 90 top
C42  6.65,181 180 top
C43  317.45,273.28 90 top
C44  159.84,192.76 0 top
C45  269.06,195.05 0 top
C63  36.93,255.19 0 top
C64  79.81,256.64 0 top
C65  120.62,259.21 0 top
C66  162.03,258.95 0 top
C67  205.46,260.48 0 top
C68  250.93,260.48 0 top
C69  285.32,252.98 0 top
C70  340.33,259.46 0 top
C71  313.41,247.78 180 top
C72  270.31,250.22 180 top
C73  225.78,247.02 180 top
C74  180.31,246.51 180 top
C75  136.63,246.51 180 top
C76  97.51,247.27 180 top
C77  61.57,250.82 180 top
C78  17.91,250.65 180 top
C93  51.82,273.89 90 top
C94  142.75,54.31 270 top
C95  148.67,34.93 90 top
CON1  8.51,10.16 90 top
D1  -199.21,-12.45 0 top  (outside the outline)
D2  -200.51,-25.35 0 top  (outside the outline)
D3  177.72,53.49 180 top
D4  160.96,54.79 270 top
D5  181.03,28.88 90 top
D6  198.5,55.02 270 top
D7  203.23,38.84 270 top
D8  198.5,38.89 270 top
D9  203.17,55.07 270 top
D10  169.42,31.34 270 top
D11  -199.21,-19.35 0 top  (outside the outline)
D12  -200.51,-41.3 0 top  (outside the outline)
D13  -199.21,-35.31 0 top  (outside the outline)
D14  -200.51,-57.25 0 top  (outside the outline)
D15  -199.21,-51.26 0 top  (outside the outline)
D16  -200.51,-73.2 0 top  (outside the outline)
D17  -199.21,-67.21 0 top  (outside the outline)
D18  -200.51,-89.15 0 top  (outside the outline)
D19  -199.21,-83.16 0 top  (outside the outline)
D20  -200.51,-105.11 0 top  (outside the outline)
D21  -199.21,-99.11 0 top  (outside the outline)
D22  -200.51,-121.06 0 top  (outside the outline)
D23  -199.21,-115.06 0 top  (outside the outline)
D41  -200.51,-2.49 0 top  (outside the outline)
F1  4.57,24 90 top
F3  4.06,16.64 90 top
FTDI  14.96,61.34 270 top
IC1  12.04,46.99 180 top
IC2  194.08,17.35 180 top
IC3  26.9,251.59 270 top
IC4  68.55,251.33 270 top
IC5  107.42,251.59 270 top
IC6  190.98,251.84 270 top
IC7  235.69,251.59 270 top
IC8  147.04,251.33 270 top
IC9  277.52,250.11 270 top
IC10  323.57,251.84 270 top
IC13  177.27,57.43 180 top
JP1  10.52,29.18 0 top
JP2  127.56,272.67 90 top
JP3  138.02,58.6 270 top
JP4  153.26,32.28 90 top
JP5  144.12,59.92 270 top
JP6  9.12,56.64 270 top
JP7  193.78,234.31 90 top
JP8  58.17,10.44 0 top
JP9  36.75,260.76 270 top
JP10  74.14,259.21 0 top
JP11  113.77,259.46 0 top
JP13  193.62,219.18 180 top
JP14  207.11,47.5 90 top
JP15  53.49,68.91 0 top
JP16  238.58,219.18 180 top
JP17  283.54,219.94 180 top
JP18  325.96,219.94 180 top
JP19  12.42,250.01 180 top
JP20  70.94,220.19 180 top
JP21  109.8,219.94 180 top
JP22  149.43,219.94 180 top
JP23  239.75,235.59 90 top
JP24  154.41,259.21 0 top
JP25  197.84,260.48 0 top
JP26  243.31,260.22 0 top
JP27  332.71,259.21 0 top
JP28  292.89,256.39 270 top
JP29  -189.61,347.98 0 top  (outside the outline)
JP30  104.29,50.22 0 top
JP31  106.81,28.3 270 top
JP32  158.24,33.6 270 top
JP33  41.81,272.54 90 top
JP34  286.03,234.8 90 top
JP35  326.87,234.31 90 top
JP36  25.73,241.73 0 top
JP37  74.65,233.81 90 top
JP38  113.77,232.03 90 top
JP39  150.85,235.84 90 top
JP42  170.41,256.92 0 top
JP43  216.38,256.92 0 top
JP44  269.77,263.25 270 top
JP45  301.22,259.21 0 top
JP46  12.98,257.02 0 top
JP47  48.74,257.94 0 top
JP48  88.37,256.92 0 top
JP49  126.72,256.67 0 top
JP55  59.77,177.27 0 top
JP56  -198.25,351.03 0 top  (outside the outline)
JP57  31.9,10.29 270 top
JP58  46.41,272.62 0 top
JP59  132.18,272.64 0 top
JP60  214.15,271.65 90 top
JP61  219,271.65 0 top
JP62  306.58,271.75 90 top
JP63  312.37,271.75 0 top
JP64  53.64,137.85 180 top
JP65  -198.17,-131.14 0 top  (outside the outline)
JP66  -198.17,-136.73 0 top  (outside the outline)
JP67  -198.17,-142.32 0 top  (outside the outline)
JP68  -198.17,-147.9 0 top  (outside the outline)
JP69  -198.17,-153.49 0 top  (outside the outline)
JP70  -198.17,-159.08 0 top  (outside the outline)
JP71  -198.17,-164.67 0 top  (outside the outline)
JP72  -198.17,-170.26 0 top  (outside the outline)
L1  54.61,62.43 180 top
L3  41.02,73.03 180 top
LED1  96.27,120.47 270 top
LED2  96.24,145.77 270 top
LED5  155.27,51.23 270 top
LED6  152.35,26.16 0 top
Q1  129.67,89.53 90 top
Q2  20.83,74.04 90 top
R1  51.13,130.38 90 top
R2  53.67,130.4 90 top
R3  56.13,130.45 90 top
R4  53.39,144.73 90 top
R5  56.16,144.7 90 top
R6  17.83,79.58 0 top
R7  123.52,89.61 90 top
R8  10.29,21.74 270 bottom
R9  7.75,21.72 270 top
R10  16.28,55.22 270 top
R11  4.93,42.67 90 bottom
R12  13.41,30.61 270 top
R13  16.48,30.61 270 top
R14  -200.05,-8.03 0 top  (outside the outline)
R15  97.16,77.85 270 top
R16  103.76,77.85 270 top
R17  17.93,248.18 0 top
R18  56.36,244.47 0 top
R19  95.48,241.68 0 top
R20  134.59,240.66 0 top
R21  20.8,245.39 0 top
R22  64.74,242.7 0 top
R23  103.35,240.41 0 top
R24  142.98,241.43 0 top
R25  177.77,240.66 0 top
R26  186.41,240.66 0 top
R27  28.57,260.81 180 top
R28  58.9,259.46 0 top
R29  64.49,259.46 0 top
R30  61.57,253.37 0 top
R31  25.7,258.29 180 top
R32  61.57,255.78 0 top
R33  98.53,258.95 0 top
R34  104.11,258.95 0 top
R35  98.27,251.59 0 top
R36  98.53,255.14 0 top
R37  17.96,254.25 180 bottom
R38  16.46,243.92 90 top
R39  35.36,245.36 90 top
R40  32.56,245.36 270 top
R41  36.93,250.29 180 top
R42  17.96,256.79 180 bottom
R43  36.88,252.83 180 top
R44  56.36,240.92 0 top
R45  94.72,237.11 0 top
R46  134.34,236.6 0 top
R47  176.5,236.6 0 top
R48  137.64,258.44 0 top
R49  145.26,258.7 0 top
R50  137.13,251.33 0 top
R51  137.39,254.89 0 top
R52  181.08,258.7 0 top
R53  186.66,258.7 0 top
R54  180.57,251.08 0 top
R55  180.57,254.89 0 top
R56  78.08,242.44 90 top
R57  74.4,245.75 270 top
R58  76.66,249.5 180 top
R59  76.15,253.29 180 top
R60  118.59,243.71 90 top
R61  111.73,243.21 180 top
R62  116.31,250.32 180 top
R63  117.32,253.87 180 top
R64  161.77,244.47 90 top
R65  155.42,245.24 180 top
R66  154.91,250.32 180 top
R67  157.45,254.38 180 top
R68  205.46,241.94 90 top
R69  197.84,243.46 180 top
R70  200.13,250.82 180 top
R71  199.87,254.38 180 top
R72  90.68,188.98 270 top
R73  223.49,236.6 0 top
R74  226.29,258.95 0 top
R75  232.13,259.21 0 top
R76  225.78,251.33 0 top
R77  226.03,255.14 0 top
R78  224.26,240.92 0 top
R79  231.88,242.19 0 top
R80  250.16,243.46 90 top
R81  243.81,244.47 180 top
R82  245.85,250.82 180 top
R83  246.1,254.38 180 top
R84  269.77,241.15 180 top
R85  309.85,236.09 0 top
R86  263.6,254.74 0 top
R87  263.68,250.8 0 top
R88  263.68,247.75 0 top
R89  269.67,256.11 180 top
R90  312.39,258.95 0 top
R91  319,259.21 0 top
R92  312.39,251.84 0 top
R93  312.14,255.4 0 top
R94  269.93,245.95 180 top
R95  269.77,236.83 0 top
R96  311.63,242.7 0 top
R97  319,241.43 0 top
R98  292.91,246.58 180 top
R99  285.45,246.63 180 top
R100  278.56,259.13 0 top
R101  285.39,249.68 180 top
R102  340.84,243.71 90 top
R103  333.22,243.97 180 top
R104  332.71,250.57 180 top
R105  335,254.13 180 top
R106  38,10.29 180 top
R107  319.25,233.81 0 top
R108  259.11,244.45 180 top
R109  232.13,234.82 0 top
R110  149.76,54.76 90 top
R111  161.39,26.21 0 top
R112  186.16,233.3 0 top
R113  88.93,126.54 180 top
R114  142.98,233.81 0 top
R115  103.61,232.79 0 top
R116  64.74,235.33 0 top
R117  20.83,240.66 0 top
R118  100.08,120.4 270 top
R119  97.64,116.23 180 top
R120  88.47,152.2 180 top
R121  100.38,145.64 270 top
R122  97.66,141.5 180 top
R123  110.74,42.55 270 top
R124  98.83,50.06 270 top
R125  -200.05,-30.89 0 top  (outside the outline)
R126  -200.05,-46.84 0 top  (outside the outline)
R127  -200.05,-62.79 0 top  (outside the outline)
R128  -200.05,-78.74 0 top  (outside the outline)
R129  -200.05,-94.69 0 top  (outside the outline)
R130  -200.05,-110.64 0 top  (outside the outline)
R131  -200.05,-126.59 0 top  (outside the outline)
RXLED  13.44,36.93 0 top
S2  14.17,73.3 270 top
SV1  100.46,90.04 270 top
T1  95,124.61 0 top
T2  95,150.27 0 top
TXLED  16.48,36.96 0 top
U1  59.05,85.22 0 top
U2  62.56,187.93 180 top
U3  36.7,273.53 180 top
U4  121.69,273.58 180 top
U5  155.27,185.14 0 top
U6  264.49,187.43 0 top
U7  106.1,42.77 90 top
U8  208.28,272.67 180 top
U9  17.12,184.18 180 top
U10  300.36,272.72 180 top

### Tracks (layer width: path | path; a pad name or v marks a point on that pad's centre or on a via)
3V3_OUT  (via drill 0.25)  (1 unrouted)
  Top 0.254: 14.4,50.7 v14.4,52.76
  Top 0.406: IC1.4 14.31,49.78 arc-45 14.13,49.33 11.95,47.15 arc-45 11.5,46.97 9.96,46.97 9.3,46.31 arc45 9.12,45.86 IC1.17 9.12,30.59 JP1.1 | JP1.1 | JP1.1 R12.2 R13.2 | v14.4,52.76 14.31,52.74
  Bottom 0.406: JP6.2 13.66,56.64 14.3,56.01 v14.4,52.76
+1.5V1  (2 unrouted)
  Top 0.254: JP33.1 JP58.1 C93.1
+1.5V2  (2 unrouted)
  Top 0.254: JP2.1 JP59.1 C20.1
+1.5V3  (2 unrouted)
  Top 0.254: JP60.1 JP61.1 C41.1
+1.5V4  (2 unrouted)
  Top 0.254: JP62.1 JP63.1 C43.1
+3V3  (9 unrouted)
  Top 0.254: JP30.1 105.46,47.78 U7.7 | R4.2 53.42,146.13 R5.2
+5V  (41 unrouted)
  Top 0.254: U9.2 C36.1 | U5.14 C44.1 | U6.14 C45.1 | C78.1 19.33,250.67 21.23,250.67 22.15,251.59 IC3.4 22.17,251.59 21.13,252.63 21.13,260.96 21.16,260.99
  Top 0.406: JP3.2 JP3.1 142.8,59.87 JP5.1 142.75,59.82 C94.1 | U3.3 U3.4 34.86,274.48
-5V  (via drill 0.25)  (16 unrouted)
  Top 0.254: C42.1 U9.21 | IC3.11 33.02,251.59 33.66,252.22 33.66,255.09 | 33.66,255.09 v33.66,257.18 | C63.1 35.43,255.09 33.66,255.09
  Top 0.406: JP4.2 156.92,33.55 JP32.1 | JP4.2 JP4.1 | C95.1 153.24,33.52 JP4.2
  Bottom 0.254: v33.66,257.18 33.66,262.08 33.02,262.71 29.72,262.71
?????  (1 unrouted)
ADCINA0  (1 unrouted)
ADCINA1  (1 unrouted)
ADCINA2  (1 unrouted)
ADCINA4  (1 unrouted)
ADCINA5  (1 unrouted)
ADCINA6  (1 unrouted)
ADCINB0  (1 unrouted)
ADCINB1  (1 unrouted)
ADCINB2
  Top 0.254: JP15.1 55.8,75.03 U1.24
ADCINB4
  Top 0.254: JP15.2 56.3,72.99 U1.25
ADCINB5
  Top 0.254: JP15.3 56.8,70.95 U1.26
ADCINB6
  Top 0.254: JP15.4 U1.27
AGND  (85 unrouted)
  Top 0.406: JP8.1 JP8.3
CBUS4
  Top 0.406: IC1.12 arc45 IC1.12 JP6.3
D+  (via drill 0.25)
  Top 0.406: IC1.15 7.8,43.35 v7.72,28.83
  Bottom 0.406: v7.72,28.83 10.29,26.34 R8.1
D-
  Top 0.406: R9.1 8.49,23.88 IC1.16
DACDIN  (1 unrouted)
DACDOUT  (1 unrouted)
DACO1  (1 unrouted)
DACO2  (1 unrouted)
DACO3  (1 unrouted)
DACO4  (1 unrouted)
DACO5  (1 unrouted)
DACO6  (1 unrouted)
DACO7  (1 unrouted)
DACO8  (1 unrouted)
DTR_RESET  (via drill 0.25)
  Top 0.254: R10.1 18.39,58.75 v18.39,72.06
  Bottom 0.254: v18.39,72.06 20.37,74.04 Q2.B
FS  (1 unrouted)
GND  (55 unrouted)
  Top 0.254: U7.1 U7.2 | R122.1 100.38,142.8 R121.2 | R119.1 100.08,117.25 R118.2 | S2.3 S2.4
  Top 0.406: IC1.25 IC1.26
GPIO34  (2 unrouted)
  Top 0.254: JP64.2 56.13,136.53 R3.2
IDK
  Top 0.254: C22.+ 167.18,59.97 IC13.3
  Top 0.406: IC13.3 172.64,57.89 D3.A | C22.+ 160.99,59.89 D4.C C31.1 149.79,59.87 R110.2 149.68,59.92 JP5.2
IDK2
  Top 0.406: IC2.3 D5.C 175.92,28.91 | C37.- 175.84,28.98 175.92,28.91 | JP32.2 C4.1 166.47,30.98 R111.2 169.37,26.21 D10.A 173.28,26.26 175.92,28.91
IN1
  Bottom 0.254: R37.1 JP19.1
IN2  (1 unrouted)
IN3  (1 unrouted)
IN4  (1 unrouted)
IN5  (1 unrouted)
IN6  (1 unrouted)
IN7  (1 unrouted)
IN8  (1 unrouted)
INT_CONTROL  (8 unrouted)
INTINP1  (1 unrouted)
  Top 0.254: JP46.1 12.98,253.92 13.54,253.37 14.07,253.37 14.71,252.73 14.71,248.82 15.34,248.18 R17.1
INTINP2  (2 unrouted)
INTINP3  (2 unrouted)
INTINP4  (2 unrouted)
INTINP5  (2 unrouted)
INTINP6  (2 unrouted)
INTINP7  (2 unrouted)
INTINP8  (2 unrouted)
INTSWITCH1  (1 unrouted)
INTSWITCH2  (1 unrouted)
INTSWITCH3  (1 unrouted)
INTSWITCH4  (1 unrouted)
INTSWITCH5  (1 unrouted)
INTSWITCH6  (1 unrouted)
INTSWITCH7  (1 unrouted)
INTSWITCH8  (1 unrouted)
JTAG_TRST  (1 unrouted)
LDACBAR  (1 unrouted)
LED1  (1 unrouted)
LIMO1  (3 unrouted)
LIMO2  (3 unrouted)
LIMO3  (3 unrouted)
LIMO4  (3 unrouted)
LIMO5  (3 unrouted)
LIMO6  (3 unrouted)
LIMO7  (3 unrouted)
LIMO8  (3 unrouted)
N$1  (1 unrouted)
N$2  (1 unrouted)
N$3  (1 unrouted)
N$4  (1 unrouted)
N$5  (1 unrouted)
N$6
  Top 0.254: R10.2 15.62,53.8 IC1.2
N$7  (2 unrouted)
N$8  (1 unrouted)
N$9
  Top 0.254: R5.1 56.19,143.26 JP64.1
N$10
  Top 0.254: JP64.3 53.39,139.37 R4.1
N$11
  Top 0.406: CON1.2 R9.2
N$12  (via drill 0.25)
  Top 0.406: CON1.3 8.51,15.9 v8.53,15.93
  Bottom 0.406: v8.53,15.93 10.29,17.68 R8.2
N$13  (via drill 0.25)
  Top 0.406: IC1.19 arc90 10.39,43.34 v10.39,41.86
  Bottom 0.406: v10.39,41.86 10.39,41.76 arc-90 9.75,41.25 R11.1
N$14
  Top 0.406: IC1.22 12.37,39.32 13,38.68 RXLED.C
N$15
  Top 0.406: IC1.23 13.02,42.18 TXLED.C
N$16
  Top 0.406: RXLED.A 13.44,32.05 R12.1
N$17
  Top 0.406: TXLED.A R13.1
N$20  (5 unrouted)
N$21  (5 unrouted)
N$22  (5 unrouted)
N$23  (2 unrouted)
N$24  (1 unrouted)
N$25  (1 unrouted)
N$26  (2 unrouted)
N$28
  Top 0.254: R38.2 16.51,245.39 R21.1 | R21.1 19.38,248.16 R17.2 19.35,248.41 19.99,249.05 IC3.6 | R21.1 19.38,243.02 C24.1 R117.1
N$29
  Top 0.254: IC3.2 26.49,254.13 27.13,254.76 R31.1 27.13,260.78 R27.2
N$30  (5 unrouted)
N$31  (2 unrouted)
N$33  (via drill 0.25)
  Top 0.254: v22.1,252.91 24.2,252.96 IC3.3
  Bottom 0.254: v22.1,252.91 20.75,254.28 R37.2 19.33,254.31 R42.2
N$35  (2 unrouted)
N$36
  Top 0.254: R39.2 R40.1 32.49,248.41 31.85,249.05 IC3.9
N$38
  Top 0.254: IC3.10 R41.2 R43.2
N$39  (2 unrouted)
N$40  (2 unrouted)
N$41  (2 unrouted)
N$42  (2 unrouted)
N$44  (2 unrouted)
N$45  (2 unrouted)
N$46  (1 unrouted)
N$47  (2 unrouted)
N$48  (2 unrouted)
N$49  (2 unrouted)
N$50  (2 unrouted)
N$51  (2 unrouted)
N$52  (2 unrouted)
N$53  (2 unrouted)
N$54  (2 unrouted)
N$55  (5 unrouted)
N$56  (2 unrouted)
N$57  (2 unrouted)
N$58  (2 unrouted)
N$59  (2 unrouted)
N$60  (2 unrouted)
N$61  (2 unrouted)
N$62  (5 unrouted)
N$63  (5 unrouted)
N$64  (2 unrouted)
N$65  (2 unrouted)
N$66  (2 unrouted)
N$67  (2 unrouted)
N$70  (1 unrouted)
N$71  (1 unrouted)
N$72  (1 unrouted)
N$73
  Top 0.406: D6.C 198.4,60 C32.1 194.33,59.97 C33.+ IC13.1 182.8,56.97 D3.C
  Bottom 0.406: D6.C D9.C
N$74  (1 unrouted)
N$75  (1 unrouted)
N$76  (1 unrouted)
N$77
  Top 0.254: U7.6 U7.5 108.28,45.52 C40.+ 106.63,51.49 JP30.2 104.27,51.46 R124.1
N$78
  Top 0.254: R123.1 110.82,44.02 C40.-
N$80
  Top 0.406: LED6.K 156.26,26.16 R111.1
N$81
  Top 0.254: JP31.1 JP31.3 108.1,29.59 C34.+ 108,34.95 U7.4 U7.3
N$82
  Top 0.254: R110.1 149.81,49.63 152.4,49.63
  Top 0.406: 152.4,49.63 LED5.A
N$83
  Top 0.254: F3.1 6.27,15.79 6.91,15.15 CON1.1
N$85  (1 unrouted)
N$86
  Top 0.406: D8.A C30.1 | C30.1 187.96,33.95 | 187.96,33.95 C23.- | C30.1 IC2.2 | D5.A 187.96,33.95
  Bottom 0.406: D8.A D7.A
N$87  (1 unrouted)
N$88  (1 unrouted)
N$89  (1 unrouted)
N$90  (1 unrouted)
N$91
  Top 0.254: U3.1 JP33.2
N$93  (1 unrouted)
N$95
  Bottom 0.406: R11.2 4.93,58.55 arc-90 5.56,59.18 JP6.1
N$96  (1 unrouted)
N$98  (1 unrouted)
N$102
  Top 0.254: R113.1 90.37,126.52 T1.2
N$104
  Top 0.254: T1.1 LED1.A 96.34,121.82 R118.1
N$105
  Top 0.254: LED1.K 96.22,119.15 R119.2
N$106
  Top 0.254: R120.1 89.92,152.17 T2.2
N$107
  Top 0.254: T2.1 96.24,150.24 LED2.A 96.27,147.07 R121.1
N$108
  Top 0.254: LED2.K R122.2
N$109
  Top 0.254: IC3.13 31.6,254.13 32.23,254.76 32.23,260.12 32.87,260.76 JP9.2
N$110
  Top 0.254: IC3.12 32.08,252.86 32.72,253.49 32.72,257.58 33.35,258.22 JP9.3
N$111
  Top 0.254: JP9.1 32.36,263.3 31.73,262.66 31.73,256.03 31.09,255.4 IC3.14
N$112  (1 unrouted)
N$113  (1 unrouted)
N$114  (1 unrouted)
N$115  (1 unrouted)
N$116  (1 unrouted)
N$117  (1 unrouted)
N$131  (1 unrouted)
N$132
  Top 0.254: U4.1 JP2.2
N$134  (1 unrouted)
N$135
  Top 0.254: U8.1 JP60.2
N$136
  Top 0.254: U10.1 JP62.2
OUT1  (3 unrouted)
  Top 0.254: R40.2 29.54,243.94 | 28.83,243.97 28.19,244.6 28.19,247.14 28.83,247.78 IC3.8
OUT2  (3 unrouted)
OUT3  (3 unrouted)
OUT4  (3 unrouted)
OUT5  (3 unrouted)
OUT6  (3 unrouted)
OUT7  (3 unrouted)
OUT8  (3 unrouted)
PLS1
  Top 0.254: JP36.1 26.31,240.46 27.71,239.06 30.48,239.06 R39.1
PLS3  (1 unrouted)
PLS4  (1 unrouted)
PLS5  (1 unrouted)
PLS6  (1 unrouted)
PLS7  (1 unrouted)
PLS8  (1 unrouted)
RES
  Top 0.254: R124.2 100.77,48.66 U7.8
RESET#  (1 unrouted)
  Top 0.254: R6.1 16.43,79.55 S2.1 | S2.1 S2.2 16.39,70 C3.1 | S2.1 16.46,76.58 Q2.E
RXD
  Top 0.406: 13.69,50.64 IC1.5 13.66,60.05 FTDI.2
SPIBCLK  (1 unrouted)
SPIBMISO  (1 unrouted)
SPIBMOSI  (1 unrouted)
SPIBSS  (1 unrouted)
SPICLK  (1 unrouted)
SV1-1
  Top 0.406: D7.C 203.22,49.96 D9.A 203.2,50.04 JP14.3
SV1-3
  Bottom 0.406: D6.A 202.06,47.07 202.22,47 | 202.22,47 JP14.1 | D8.C 202.22,47
SWITCH1  (1 unrouted)
SWITCH2  (1 unrouted)
SWITCH3  (1 unrouted)
SWITCH4  (1 unrouted)
SWITCH5  (1 unrouted)
SWITCH6  (1 unrouted)
SWITCH7  (1 unrouted)
SWITCH8  (1 unrouted)
TCK  (2 unrouted)
TDI  (1 unrouted)
TDO  (2 unrouted)
  Top 0.254: JP64.4 53.67,136.55 R2.2
TMS  (1 unrouted)
TMS_RXD  (1 unrouted)
TMS_TXD  (1 unrouted)
TRST  (1 unrouted)
  Top 0.254: JP64.6 51.13,136.55 R1.2
TXD  (via drill 0.25)
  Top 0.254: v17.93,52.88 17.93,52.28 IC1.1
  Bottom 0.254: FTDI.4 17.3,60.07 17.93,59.44 v17.93,52.88
USB_VCC  (5 unrouted)
  Top 0.406: F3.2 C21.1 arc-90 C21.1 F1.1
VCC  (via drill 0.25)
  Top 0.254: IC1.20 11.06,42.38 11.12,42.32 11.15,37.19 v10.29,36.32
  Top 0.406: F1.2 arc90 F1.2 C12.1 C19.1 v5.97,31.11
  Bottom 0.406: v5.97,31.11 9.65,31.11 arc90 10.29,31.75 v10.29,36.32
VDDIO  (15 unrouted)
X1  (1 unrouted)
  Top 0.254: IC3.7 22.23,245.7 R21.2 22.23,243.02 | 22.23,243.02 C24.2 | 22.23,243.02 25.71,243.02 JP36.2
X1CLK  (1 unrouted)
  Top 0.254: R7.2 Q1.2 C1.1
X1DOT  (via drill 0.25)
  Top 0.254: IC3.1 24.3,258.28 R31.2 22.17,258.29 v22.15,258.32
  Bottom 0.254: v22.15,258.32 13.01,258.32 JP46.2
X2  (4 unrouted)
X2CLK  (1 unrouted)
  Top 0.254: R7.1 Q1.1 130,87.12 C2.1
X2DOT  (2 unrouted)
X3  (4 unrouted)
X3DOT  (2 unrouted)
X4  (4 unrouted)
X4DOT  (2 unrouted)
X5  (4 unrouted)
X5DOT  (2 unrouted)
X6  (4 unrouted)
X6DOT  (2 unrouted)
X7  (4 unrouted)
X7DOT  (2 unrouted)
X8  (4 unrouted)
X8DOT  (2 unrouted)